# EasyEDA Pro project ProDoc_TB6612.epro

# Schematic Schematic1_1

## Sheets
1 stm32最小系统: Create Date: 2023-11-04; Page Name: stm32最小系统; Project Name: 四电机驱动板1; Schematic Name: Schematic1_1; Update Date: 2023-11-05; Add into BOM: yes; Convert to PCB: yes
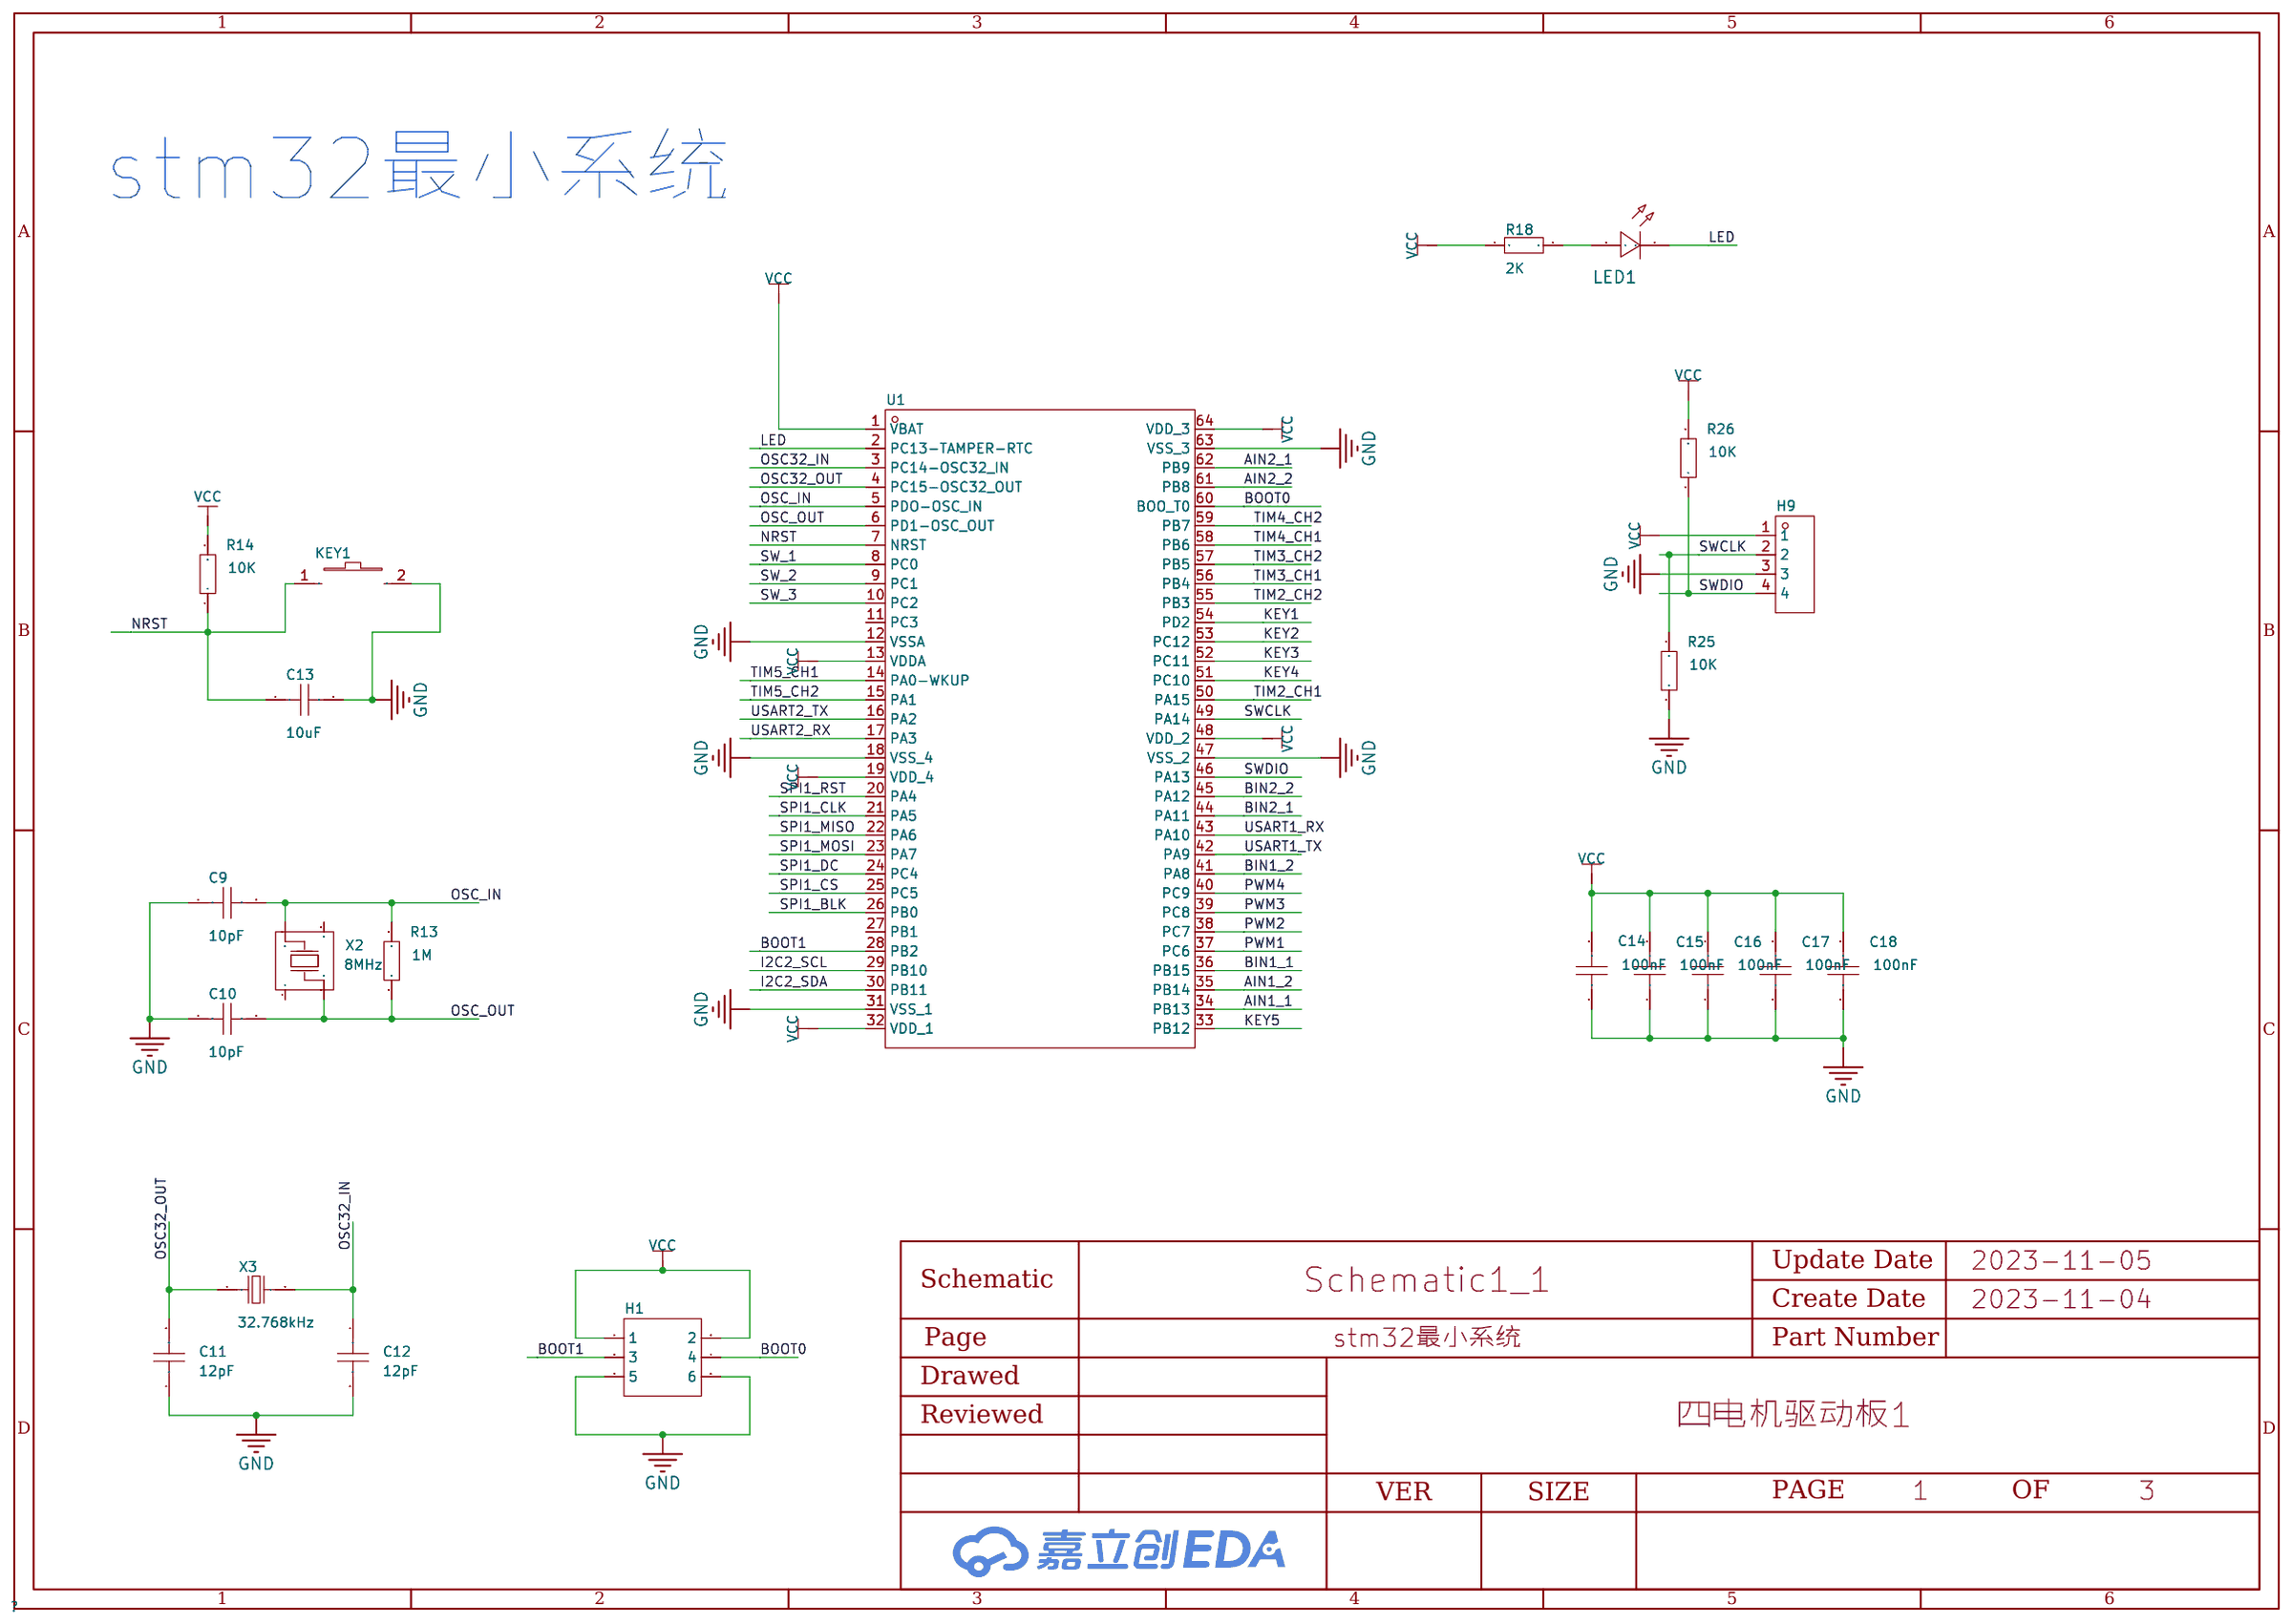
[diagram p0: stm32最小系统]
2 电机驱动TB6612: Page Name: 电机驱动TB6612.Schematic1_1; Company: 嘉立创EDA; Page Size: A4; Version: V1.0
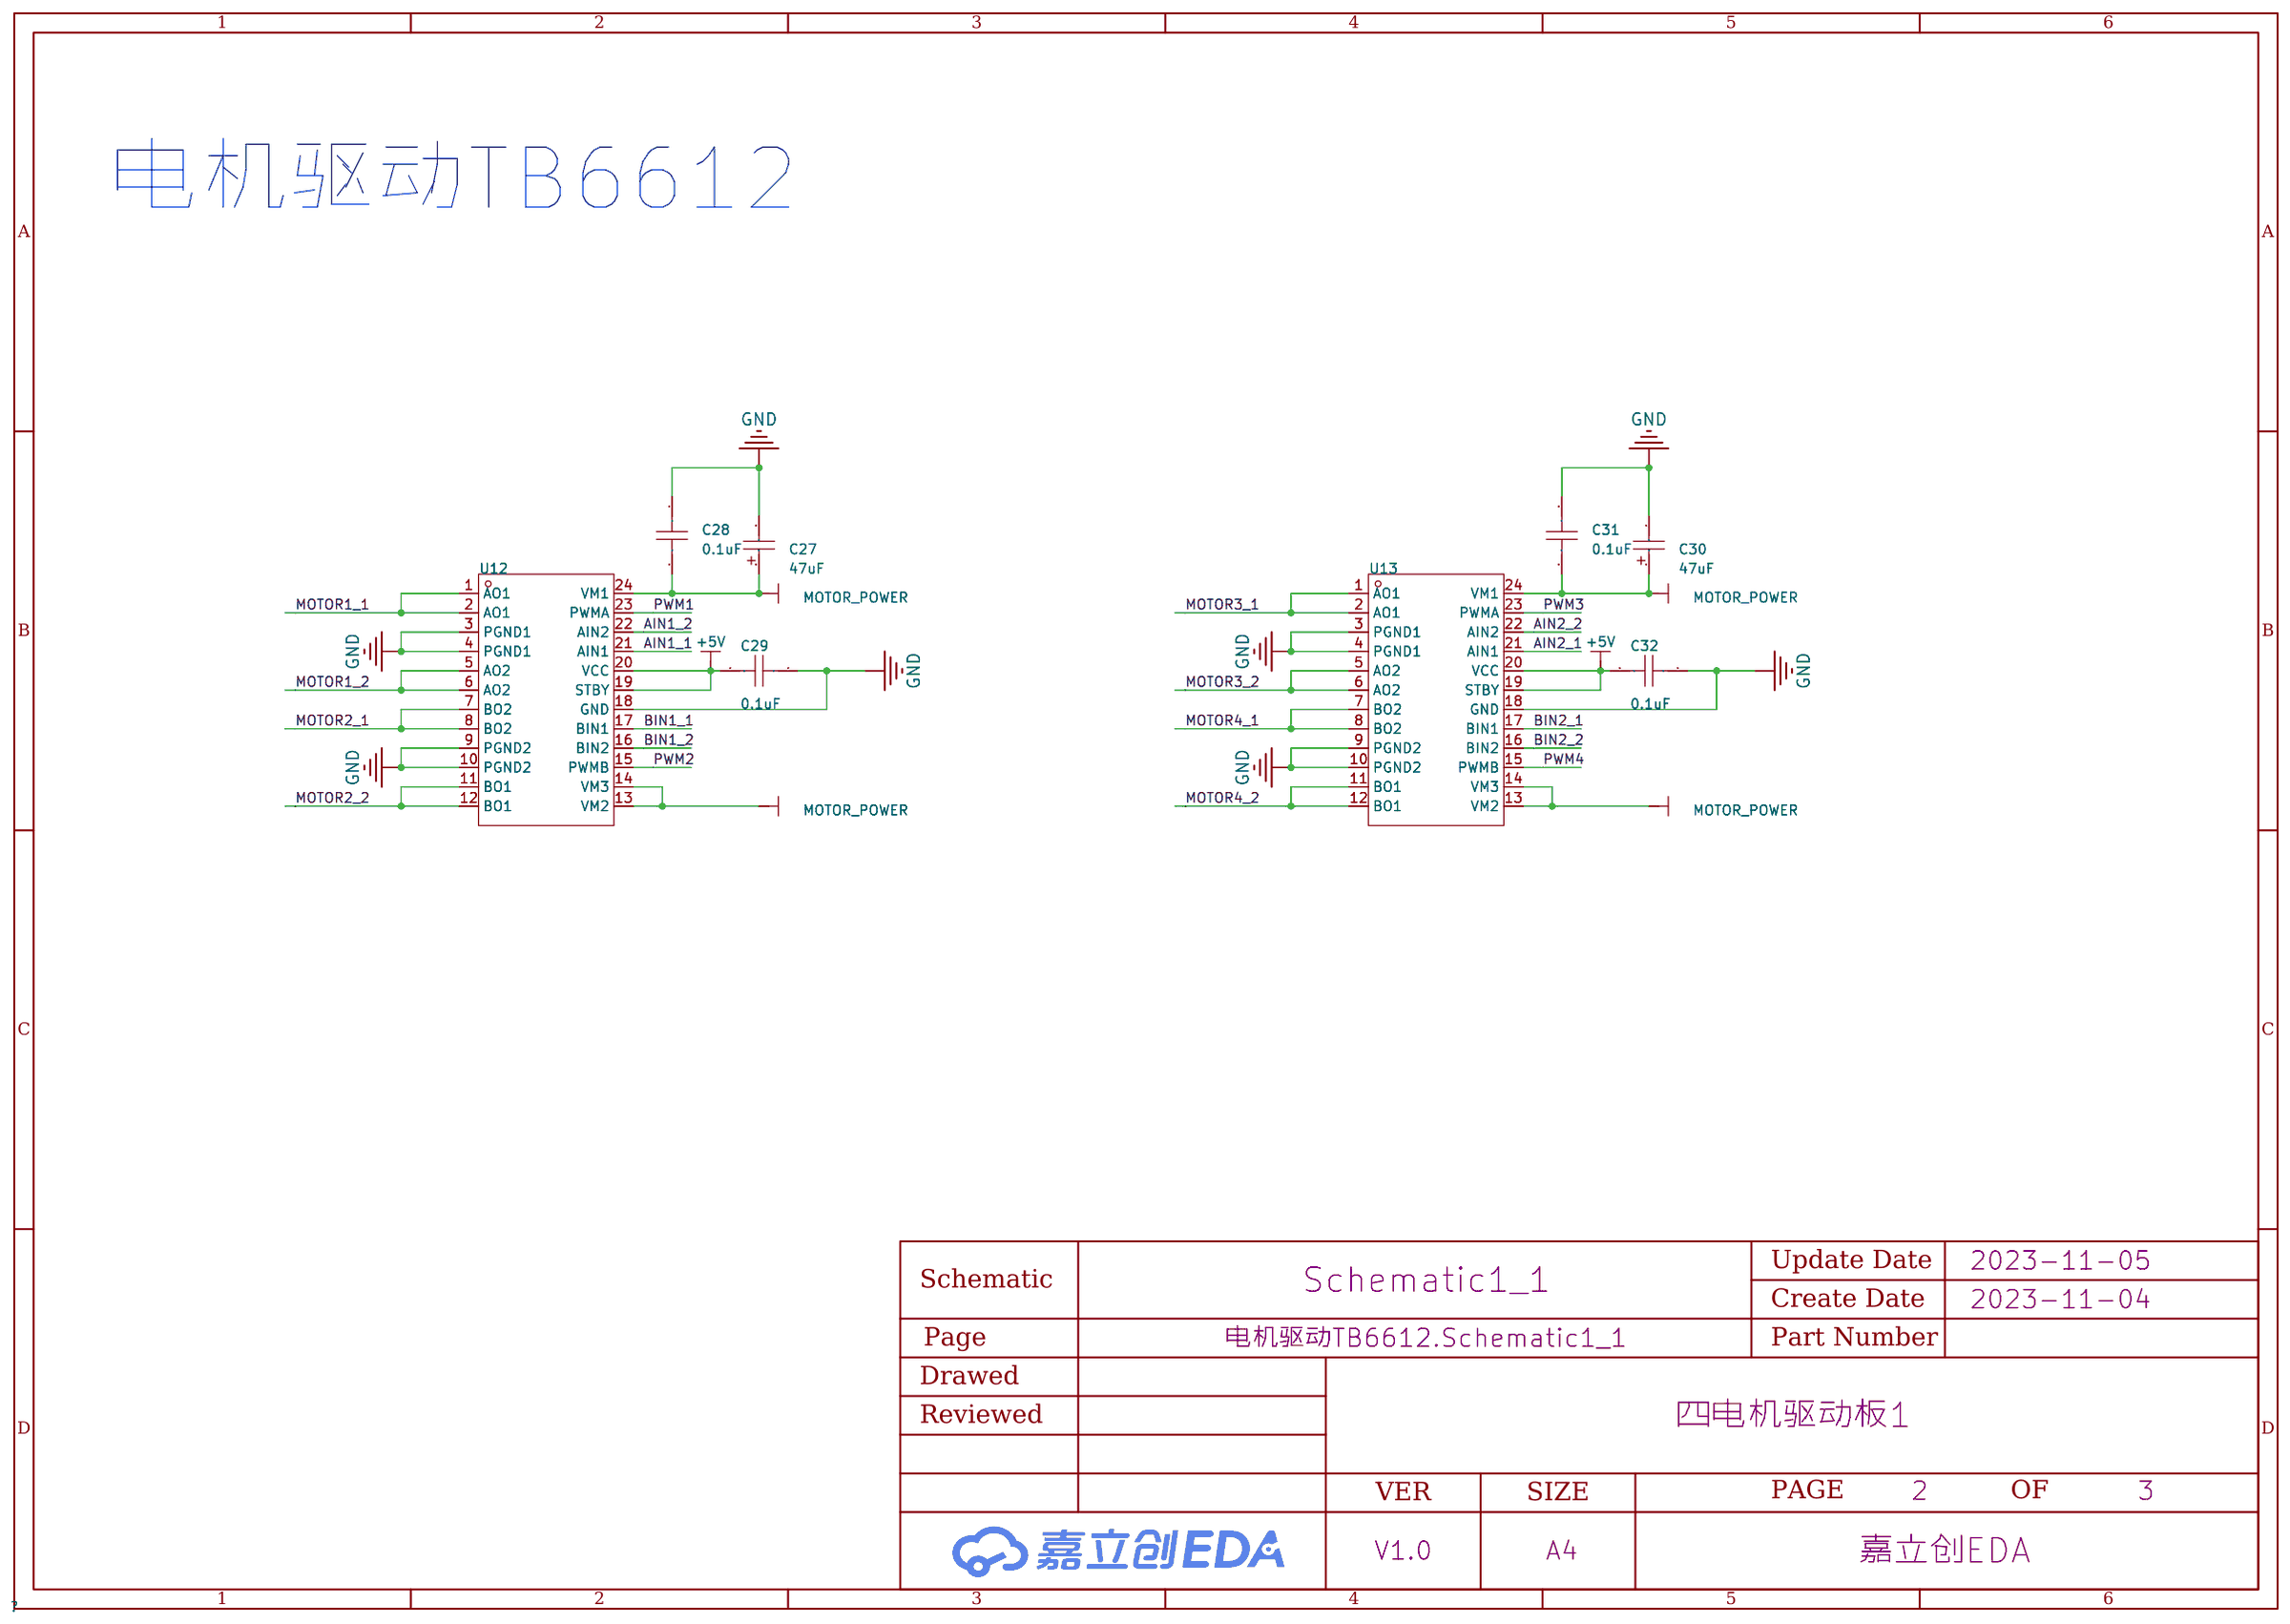
[diagram p1: 电机驱动TB6612]
3 其他模块: Page Name: 其他模块; Update Date: 2023-11-04; Company: 嘉立创EDA; Page Size: A4; Version: V1.0
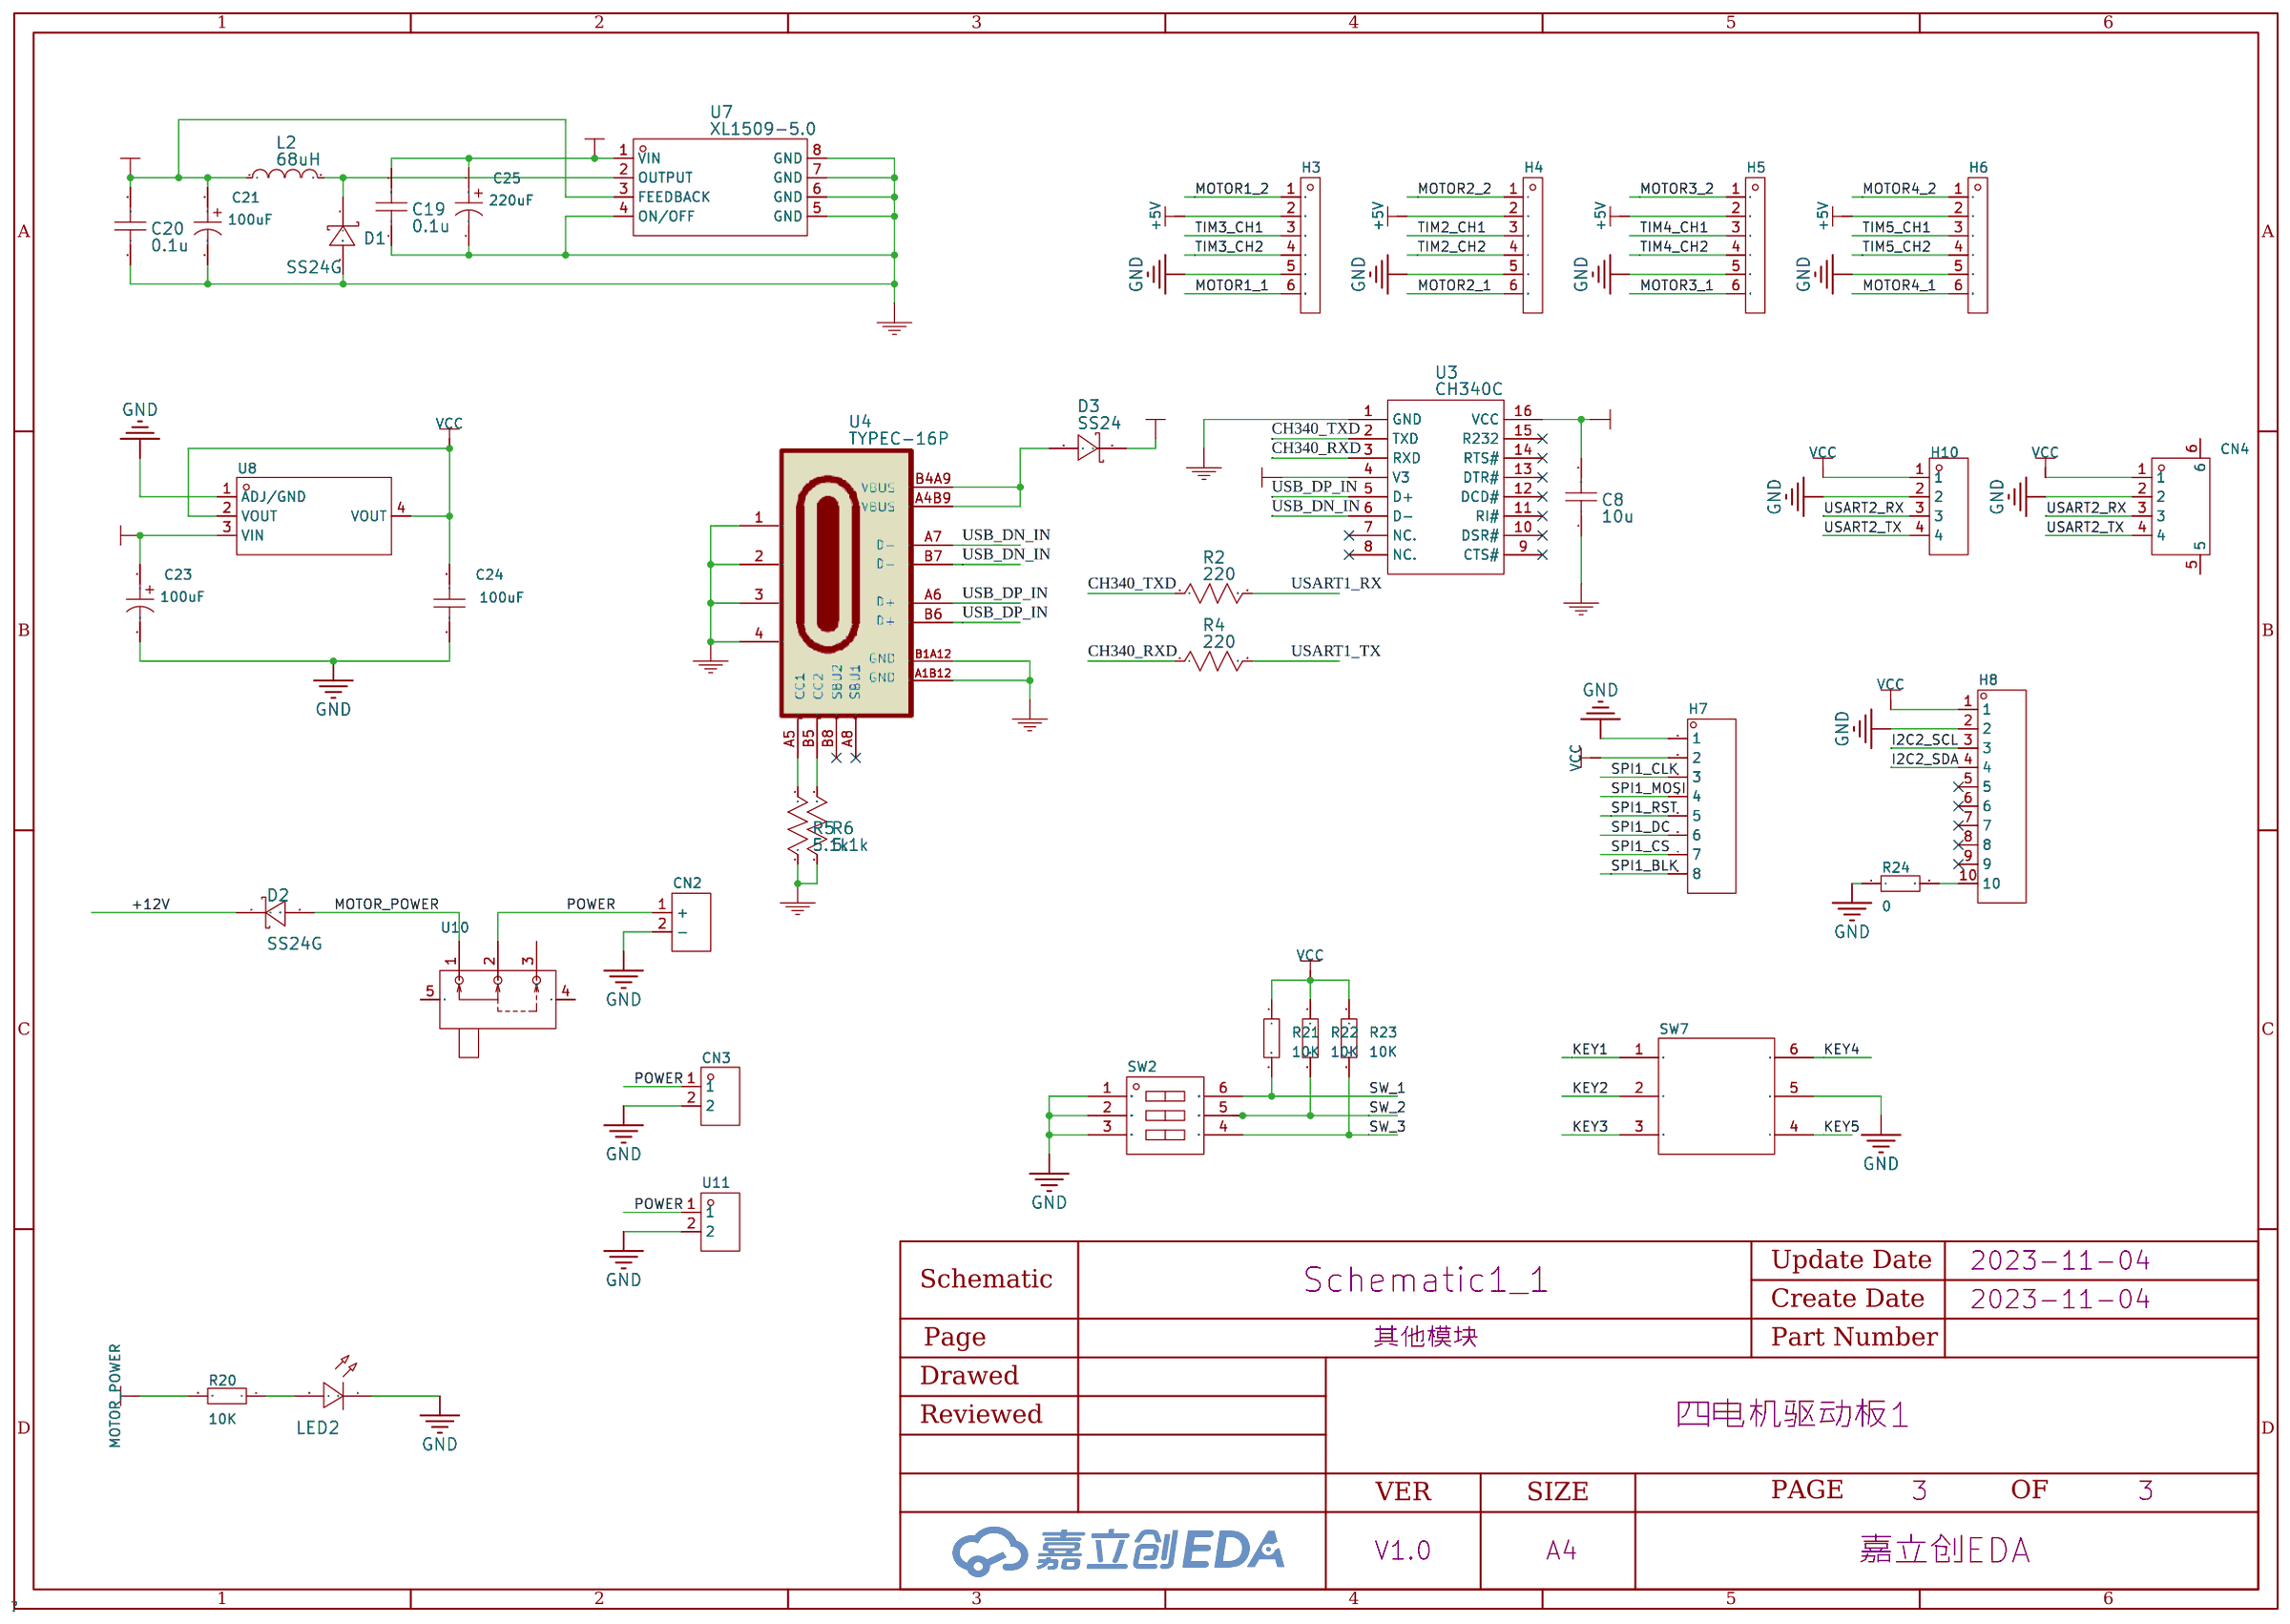
[diagram p2: 其他模块]

## Parts
sheet stm32最小系统
C9  10pF  [C0603]
C10  10pF  [C0603]
C11  12pF  [C0603]
C12  12pF  [C0603]
C13  10uF  [C0603]
C14  100nF  [C0603]
C15  100nF  [C0603]
C16  100nF  [C0603]
C17  100nF  [C0603]
C18  100nF  [C0603]
H1  -  [HDR-TH_6P-P2.54-V-F-R2-C3-S2.54]
H9  -  [HDR-TH_4P-P2.54-V-M]
KEY1  轻触开关3x4x2  [SW-SMD_L4.0-W2.9-LS5.0]
LED1  -  [LED0805-RD_RED]
R13  1M  [R0603]
R14  10K  [R0603]
R18  2K  [R0603]
R25  10K  [R0603]
R26  10K  [R0603]
U1  -  [LQFP-64_L10.0-W10.0-P0.50-LS12.0-BL]
X2  8MHz  [OSC-SMD_4P-L3.2-W2.5-BL]
X3  32.768kHz  [FC-135R_L3.2-W1.5]
sheet 其他模块
C8  10u  [C0603]
C19  0.1u  [C0603]
C20  0.1u  [C0603]
C21  100uF  [CAP-SMD_BD6.3-L6.6-W6.6-LS7.3-FD]
C23  100uF  [CAP-SMD_BD6.3-L6.6-W6.6-LS7.3-FD]
C24  100uF  [C0603]
C25  220uF  [CAP-SMD_BD6.3-L6.6-W6.6-LS7.3-FD]
CN2  XT30UPB-F  [CONN-TH_XT30UPB-F]
CN3  XT30U-M  [CONN-TH_XT30U-M]
CN4  PH-4P卧贴  [CONN-SMD_PH2.0-4PWB]
D1  SS24G  [SMA_L4.4-W2.8-LS5.4-RD]
D2  SS24G  [SMA_L4.4-W2.8-LS5.4-RD]
D3  SS24  [SMA_L4.3-W2.6-LS5.2-RD]
H3  -  [CONN-TH_XH-6AW]
H4  -  [CONN-TH_XH-6AW]
H5  -  [CONN-TH_XH-6AW]
H6  -  [CONN-TH_XH-6AW]
H7  -  [HDR-TH_8P-P2.54-V-M]
H8  -  [HDR-TH_10P-P2.54-V-M-1]
H10  -  [HDR-TH_4P-P2.54-V-F]
L2  68uH  [IND-SMD_L5.8-W5.2_CD54T125NP-100MC]
LED2  -  [LED0805-RD_RED]
R2  220  [R0603]
R4  220  [R0603]
R5  5.1k  [R0603]
R6  5.1k  [R0603]
R20  10K  [R0603]
R21  10K  [R0603]
R22  10K  [R0603]
R23  10K  [R0603]
R24  0  [R0603]
SW2  TO-03  [SW-SMD_6P-L7.6-W6.3-P2.54-LS9.8]
SW7  7*7*5-6P-L WX  [SW-SMD_6P-L7.0-W7.0-P1.40-LS7.4]
U3  CH340C  [SOP-16_L10.0-W3.9-P1.27-LS6.0-BL]
U4  TYPEC-16P  [TYPEC]
U7  XL1509-5.0  [SOIC-8_L5.0-W4.0-P1.27-LS6.0-BL]
U8  AMS1117-3.3  [SOT-223_L6.5-W3.5-P2.30-LS7.0-BR]
U10  SS-12F23-G4  [SW-TH_SS-12F23-G040]
U11  KF127-5.08-2P  [CONN-TH_P5.08_KF127-5.08-2P]
sheet 电机驱动TB6612
C27  47uF  [CAP-SMD_L6.0-W3.2-R-RD]
C28  0.1uF  [C0603]
C29  0.1uF  [C0603]
C30  47uF  [CAP-SMD_L6.0-W3.2-R-RD]
C31  0.1uF  [C0603]
C32  0.1uF  [C0603]
U12  TB6612FNG(O,C,8,EL  [SSOP-24_L8.4-W5.8-P0.65-LS7.8-BL]
U13  TB6612FNG(O,C,8,EL  [SSOP-24_L8.4-W5.8-P0.65-LS7.8-BL]

## Library data of the parts
C9-C12 C24 C28 C29 C31 C32 = CAP_0603: Supplier Footprint: 0603
C13 = C0603: 容值:100nF;精度:±10%;额定电压:50V;材质(温度系数):X7R;; LCSC Part Name: 100nF ±10% 50V; Supplier Part: C14663; Manufacturer: YAGEO(国巨); Manufacturer Part: CC0603KRX7R9BB104; Supplier Footprint: 0603; JLCPCB Part Class: Basic Part; Datasheet: https://atta.szlcsc.com/upload/public/pdf/source/20170116/1484561234239.pdf; Supplier: LCSC; Tolerance: ±10%; Voltage Rated: 50V; Temperature Coefficient: X7R
C14-C18 = CAP_0805: Supplier Footprint: 0805
H1 = HDR-F_2.54_2x3: Supplier Part: C92272; Supplier Footprint: 插件
H9 = HDR-M_2.54_1x4P: Supplier Part: C492403; Supplier Footprint: 插件
KEY1 = 轻触开关3x4x2: 触点电流:50mA;额定电压(DC):12V;电路结构:单刀单掷;安装方式:立贴;按钮形状:圆形按钮;带灯:-;开关长度:4mm;开关宽度:3mm;开关高度:2mm;; LCSC Part Name: 3x4x2  柱高0.5; Supplier Part: C26638; Manufacturer: 国产; Supplier Footprint: SMD; JLCPCB Part Class: 扩展库; Datasheet: https://atta.szlcsc.com/upload/public/pdf/source/20150923/1457707412058.pdf; Supplier: LCSC; Contact Current: 50mA; Voltage Rating (DC): 12V; Circuit: 单刀单掷; Mounting Style: 立贴; Actuator Style: 圆形按钮; Switch Length: 4mm; Switch Width: 3mm; Switch Height: 2mm
LED1 LED2 = LED_0805-R: Supplier Footprint: 0805
R13 R14 R18 R20-R26 = Res_0603: Supplier Footprint: 0603
U1 = STM32F103RCT6: 主频（MAX):72MHz;工作电压:2V ~ 3.6V;; Supplier Part: C8323; Manufacturer: ST(意法半导体); Supplier Footprint: LQFP-64_10x10x05P; JLCPCB Part Class: Extended Part; Datasheet: https://atta.szlcsc.com/upload/public/pdf/source/20161130/1480498797345.pdf; Supplier: LCSC; Speed: 72MHz; Voltage - Supply (Vcc/Vdd): 2V ~ 3.6V; Program Memory Size: 256KB; RAM Size: 48KB; Number of I/O: 51; A/D: 16x12bit; D/A: 2x12bit; PWM: 18; LCD: LCD parallel interface, 8080/6800 modes; UART/USART: 3 USART+2 UART; SPI: 3; I2C（SMBUS/PMBUS）: 2; USB Device: 1; CAN: 1
X2 = TAXM8M4RDBCCT2T: 晶振类型:SMD 谐振器;频率:8MHz;频率公差:±10ppm;频率稳定度:±15ppm;负载电容:10pF;等效串联电阻(ESR):250Ω;工作温度:-;; LCSC Part Name: 8MHz ±10ppm 10pF; Supplier Part: C400090; Manufacturer: TAE(雅晶鑫); Supplier Footprint: SMD3225-4P; JLCPCB Part Class: 扩展库; Datasheet: https://atta.szlcsc.com/upload/public/pdf/source/20190626/C400090_CF95B89E745AFE4EF2E392EF8AC009D6.pdf; Supplier: LCSC; Crystal Type: SMD 谐振器; Frequency Tolerance: ±10ppm; Frequency Stability: ±15ppm; Load Capacitance: 10pF; Equivalent Series Resistance (ESR): 250Ω
X3 = Q13FC1350000400: 晶振类型:贴片无源晶振;频率:32.768kHz;频率公差:±20ppm;负载电容:12.5pF;等效串联电阻(ESR):70kΩ;工作温度:-40~+85;; LCSC Part Name: 32.768kHz ±20ppm 12.5pF; Supplier Part: C32346; Manufacturer: EPSON(爱普生); Supplier Footprint: SMD3215-2P; JLCPCB Part Class: 基础库; Datasheet: https://atta.szlcsc.com/upload/public/pdf/source/20190108/C32346_746D6B07EAF90824457A96480007685F.pdf; Supplier: LCSC; Crystal Type: 贴片无源晶振; Frequency Tolerance: ±20ppm; Load Capacitance: 12.5pF; Equivalent Series Resistance (ESR): 70kΩ; Operating Temperature: -40~+85
C8 = 10u
C19 C20 = 0.1u
C21 C23 = XT100UF16V90RV0074: 容值:100uF;精度:±20%;额定电压:16V;电容体直径:6.3mm;电容体长度:7.7mm;纹波电流:85mA@120Hz;工作寿命:2000hrs@105;工作温度:-55~+105;; LCSC Part Name: 100uF ±20% 16V; Supplier Part: C2992605; Manufacturer: KNSCHA(科尼盛); Supplier Footprint: SMD,D6.3xL7.7mm; Datasheet: https://atta.szlcsc.com/upload/public/pdf/source/20220628/7CAC947F1CF7B3760324B7CEF365CD7C.pdf; Supplier: LCSC; Tolerance: ±20%; Rated Voltage: 16V; φD: 6.3mm; L: 7.7mm; Ripple Current: 85mA@120Hz; Lifetime @ Temp: 2000hrs@105; Operating Temperature: -55~+105
C25 = XT220UF25V90RV0075: 容值:220uF;额定电压:25V;电容体直径:-;电容体长度:-;纹波电流:-;等效串联电阻:-;工作寿命:-;; LCSC Part Name: 220uF 25V; Supplier Part: C2992606; Manufacturer: KNSCHA(科尼盛); Supplier Footprint: SMD,6.3x7.7mm; JLCPCB Part Class: 扩展库; Datasheet: https://atta.szlcsc.com/upload/public/pdf/source/20220628/B81E91792433B702C6CB5381AD404A15.pdf; Supplier: LCSC; Rated Voltage: 25V
CN2 = XT30UPB-F: 模型插头连接器; Supplier Part: C108769; Manufacturer: AMASS(艾迈斯); Supplier Footprint: 间距5mm; JLCPCB Part Class: 扩展库; Datasheet: https://atta.szlcsc.com/upload/public/pdf/source/20180126/C108769_15169557890251308829.pdf; Supplier: LCSC
CN3 = XT30U-M: 模型插头轻量版锂电池插头; LCSC Part Name: XT30U-M 公头; Supplier Part: C99101; Manufacturer: AMASS(艾迈斯); JLCPCB Part Class: 扩展库; Datasheet: https://atta.szlcsc.com/upload/public/pdf/source/20170606/1496716542582.pdf; Supplier: LCSC
CN4 = PH-4P卧贴: 参考系列:PH;间距:2mm;插针结构:1x4P;排数:1;每排PIN数:4;行距:-;安装方式:-;触头材质:-;; LCSC Part Name: PH2.0-4PWB  4P 间距2.0mm; Supplier Part: C50137; Manufacturer: BOOMELE(博穆精密); Supplier Footprint: SMD,P=2mm; JLCPCB Part Class: 扩展库; Datasheet: https://atta.szlcsc.com/upload/public/pdf/source/20201021/C50137_92282A9B69C22D3BCC62949EB13F278D.pdf; Supplier: LCSC; Reference Series: PH; Pitch: 2mm; Pins Structure: 1x4P; Number of Rows: 1; Number of PINs Per Row: 4
D1 D2 = SS24G: Supplier: LCSC; Supplier Part: C183481; Manufacturer: SK; JLCPCB Part Class: Extended Part
D3 = SS24: Supplier: LCSC; Manufacturer: MDD; Supplier Part: C50645; JLCPCB Part Class: Extended Part
H3-H6 = XH2.54-6P卧插: 参考系列:XH;间距:2.5mm;插针结构:1x6P;排数:1;每排PIN数:6;行距:-;安装方式:-;触头材质:-;; LCSC Part Name: XH-6AW，6P，脚距2.5mm，卧插; Supplier Part: C8876; Manufacturer: BOOMELE(博穆精密); Manufacturer Part: XH-6AW; LCSC On Sale: 1; Supplier Footprint: 插件,P=2.5mm; JLCPCB On Sale: 1; Datasheet: https://atta.szlcsc.com/upload/public/pdf/source/20151222/1457707652916.pdf; Supplier: LCSC; Reference Series: XH; Pitch: 2.5mm; Pins Structure: 1x6P; Number of Rows: 1; Number of PINs Per Row: 6; JLCPCB Part Class: 扩展库
H7 = HDR-M_2.54_1x8P: Supplier Part: C124381; Supplier Footprint: 插件
H8 = HDR-M_2.54_1x10P: Supplier Part: C57369; Supplier Footprint: 插件
H10 = HDR-F_2.54_1x4P: Supplier Part: C2718488; Supplier Footprint: 插件
L2 = CD54T125NP-100MC: Supplier: LCSC; Supplier Part: C171575; Manufacturer: Sumida; JLCPCB Part Class: Extended Part
R2 R4 = 220
R5 R6 = 5.1k
SW2 = TO-03: 拨码开关贴片黑色03P-3PIN间距2.54mm立式贴片正拨平拨3位SMD; LCSC Part Name: 拨码开关贴片黑色03P-3PIN间距2.54mm立式贴片正拨平拨3位SMD; Supplier Part: C703800; Manufacturer: Yuandi(台湾元迪); Supplier Footprint: SMD; JLCPCB Part Class: 扩展库; Datasheet: https://atta.szlcsc.com/upload/public/pdf/source/20200720/C703800_80E8AF9DC4C3CB8A32EAD0AE4E67587B.pdf; Supplier: LCSC
SW7 = 7*7*5-6P-L WX: 额定电流(DC)：50mA 额定电压(DC)：12V 电路结构：单刀五掷 机械寿命：30000 安装方式：SMD 工作温度：-20~+70 开关长度：7.4mm 开关宽度：7.4mm 开关高度：5mm; Supplier Part: C2858287; Manufacturer: SHOU HAN(首韩); Supplier Footprint: SMD; JLCPCB Part Class: 扩展库; Datasheet: https://atta.szlcsc.com/upload/public/pdf/source/20210806/C2858287_7956E179246BF43E1C1955FBC790E2E6.pdf; Supplier: LCSC
U3 = CH340C: Supplier: LCSC; Manufacturer: WCH(南京沁恒); Supplier Part: C84681; JLCPCB Part Class: Extended Part
U4 = TYPEC-16P
U7 = XL1509-5.0: Supplier: LCSC; Supplier Part: C2681225; Manufacturer: UMW(友台半导体); JLCPCB Part Class: Extended Part
U8 = AMS1117-3.3_C351785: Supplier Part: C351785; Manufacturer: PUOLOP(迪浦); Supplier Footprint: SOT-223; JLCPCB Part Class: 扩展库; Datasheet: https://atta.szlcsc.com/upload/public/pdf/source/20210915/EA806799CEEC3F52E0A4FA8303A508AC.pdf; Supplier: LCSC
U10 = SS-12F23-G4: 电路结构:单刀双掷;安装方式:卧插;开关颜色:黑色;滑钮形状:矩形柱状;引脚样式:PC引脚;开关长度:13mm;开关宽度:5.8mm;开关高度:9mm;; LCSC Part Name: 拨动开关; Supplier Part: C2998806; Manufacturer: DEALON(德艺隆); Supplier Footprint: 插件; JLCPCB Part Class: 扩展库; Datasheet: https://atta.szlcsc.com/upload/public/pdf/source/20220428/B341684C4335C21BC408331FBC341DAE.pdf; Supplier: LCSC; Circuit: 单刀双掷; Mounting Style: 卧插; Actuator Color: 黑色; Actuator Style: 矩形柱状; Pin Style: PC引脚; Switch Length: 13mm; Switch Width: 5.8mm; Switch Height: 9mm
U11 = KF127-5.08-2P: 间距:5.08mm;排数:1;每排PIN数:2;安装方式:直针;额定电流:15A;额定电压:250V;线规 - AWG:14~26;线规 - mm?:1.5;工作温度范围:-40~+105;颜色:绿色;; LCSC Part Name: 5.08mm 排数:1 每排P数:2 直针 可拼接 铜 环保; Supplier Part: C474906; Manufacturer: KEFA(科发); Supplier Footprint: P=5.08mm; JLCPCB Part Class: 扩展库; Datasheet: https://atta.szlcsc.com/upload/public/pdf/source/20200115/C474906_30398C25D2112436770FB13658A99DF4.pdf; Supplier: LCSC; Pitch: 5.08mm; Number of Rows: 1; Number of PINs Per Row: 2; Mounting Style: 直针; Current Rating (Max): 15A; Voltage Rating (Max): 250V; Wire Gauge - AWG: 14~26; Wire Gauge - mm?: 1.5; Operating Temperature Range: -40~+105; Color: 绿色
C27 C30 = TAJC476K016RNJ: 容值:47uF;精度:±10%;额定电压:16V;等效串联电阻:500mΩ@100kHz;; LCSC Part Name: 47uF ±10% 16V; Supplier Part: C7219; Manufacturer: Kyocera AVX; Supplier Footprint: CASE-C-6032; JLCPCB Part Class: 扩展库; Datasheet: https://atta.szlcsc.com/upload/public/pdf/source/20160107/1457707749304.pdf; Supplier: LCSC; Tolerance: ±10%; Rated Voltage: 16V; Equivalent Series Resistance(ESR): 500mΩ@100kHz; Operating Temperature: -55℃~+125℃
U12 U13 = TB6612FNG(O,C,8,EL: 双直流电机驱动器集成电路; Supplier Part: C88224; Manufacturer: TOSHIBA(东芝); Supplier Footprint: SSOP-24-208mil; JLCPCB Part Class: 扩展库; Datasheet: https://atta.szlcsc.com/upload/public/pdf/source/20170412/1491969113864.pdf; Supplier: LCSC

## Nets
+5V: C20.2 C21.1 C23.1 C29.2 C32.2 D3.1(K) H3.2 H4.2 H5.2 H6.2 L2.1 U7.3(FEEDBACK) U8.3(VIN) U12.19(STBY) U12.20(VCC) U13.19(STBY) U13.20(VCC)
+12V: C19.2 C25.1 D2.1 U7.1(VIN)
GND: C8.1 C9.1 C10.1 C11.1 C12.2 C13.2 C14.1 C15.1 C16.1 C17.1 C18.1 C19.1 C20.1 C21.2 C23.2 C24.1 C25.2 C27.2 C28.1 C29.1 C30.2 C31.1 C32.1 CN2.2(-) CN3.2 CN4.2 D1.2 H1.5 H1.6 H3.5 H4.5 H5.5 H6.5 H7.1 H8.2 H9.3 H10.2 KEY1.2 LED2.1(C) R5.1 R6.1 R24.1 R25.1 SW2.1(PIN1) SW2.2(PIN2) SW2.3(PIN3) SW7.5 U1.12(VSSA) U1.18(VSS_4) U1.31(VSS_1) U1.47(VSS_2) U1.63(VSS_3) U3.1(GND) U4.1 U4.2(1) U4.3(1) U4.4(1) U4.A1B12(1) U4.B1A12(1) U7.4(ON/OFF) U7.5(GND) U7.6(GND) U7.7(GND) U7.8(GND) U8.1(ADJ/GND) U11.2 U12.3(PGND1) U12.4(PGND1) U12.9(PGND2) U12.10(PGND2) U12.18(GND) U13.3(PGND1) U13.4(PGND1) U13.9(PGND2) U13.10(PGND2) U13.18(GND)
VCC: C8.2 C14.2 C15.2 C16.2 C17.2 C18.2 C24.2 CN4.1 H1.1 H1.2 H7.2 H8.1 H9.1 H10.1 R14.2 R18.2 R21.1 R22.1 R23.1 R26.2 U1.1(VBAT) U1.13(VDDA) U1.19(VDD_4) U1.32(VDD_1) U1.48(VDD_2) U1.64(VDD_3) U3.4(V3) U3.16(VCC) U8.2(VOUT) U8.4(VOUT)
AIN1_1: U1.34(PB13) U12.21(AIN1)
AIN1_2: U1.35(PB14) U12.22(AIN2)
AIN2_1: U1.62(PB9) U13.21(AIN1)
AIN2_2: U1.61(PB8) U13.22(AIN2)
BIN1_1: U1.36(PB15) U12.17(BIN1)
BIN1_2: U1.41(PA8) U12.16(BIN2)
BIN2_1: U1.44(PA11) U13.17(BIN1)
BIN2_2: U1.45(PA12) U13.16(BIN2)
BOOT0: H1.4 U1.60(BOO_T0)
BOOT1: H1.3 U1.28(PB2)
CH340_RXD: R4.1 U3.3(RXD)
CH340_TXD: R2.1 U3.2(TXD)
I2C2_SCL: H8.3 U1.29(PB10)
I2C2_SDA: H8.4 U1.30(PB11)
KEY1: SW7.1 U1.54(PD2)
KEY2: SW7.2 U1.53(PC12)
KEY3: SW7.3 U1.52(PC11)
KEY4: SW7.6 U1.51(PC10)
KEY5: SW7.4 U1.33(PB12)
LED: LED1.1(C) U1.2(PC13-TAMPER-RTC)
MOTOR1_1: H3.6 U12.1(AO1) U12.2(AO1)
MOTOR1_2: H3.1 U12.5(AO2) U12.6(AO2)
MOTOR2_1: H4.6 U12.7(BO2) U12.8(BO2)
MOTOR2_2: H4.1 U12.11(BO1) U12.12(BO1)
MOTOR3_1: H5.6 U13.1(AO1) U13.2(AO1)
MOTOR3_2: H5.1 U13.5(AO2) U13.6(AO2)
MOTOR4_1: H6.6 U13.7(BO2) U13.8(BO2)
MOTOR4_2: H6.1 U13.11(BO1) U13.12(BO1)
MOTOR_POWER: C27.1 C28.2 C30.1 C31.2 D2.2 R20.2 U10.1 U12.13(VM2) U12.14(VM3) U12.24(VM1) U13.13(VM2) U13.14(VM3) U13.24(VM1)
NRST: C13.1 KEY1.1 R14.1 U1.7(NRST)
OSC32_IN: C12.1 U1.3(PC14-OSC32_IN) X3.2
OSC32_OUT: C11.2 U1.4(PC15-OSC32_OUT) X3.1
OSC_IN: C9.2 R13.2 U1.5(PDO-OSC_IN) X2.3
OSC_OUT: C10.2 R13.1 U1.6(PD1-OSC_OUT) X2.1
POWER: CN2.1(+) CN3.1 U10.2 U11.1
PWM1: U1.37(PC6) U12.23(PWMA)
PWM2: U1.38(PC7) U12.15(PWMB)
PWM3: U1.39(PC8) U13.23(PWMA)
PWM4: U1.40(PC9) U13.15(PWMB)
SPI1_BLK: H7.8 U1.26(PB0)
SPI1_CLK: H7.3 U1.21(PA5)
SPI1_CS: H7.7 U1.25(PC5)
SPI1_DC: H7.6 U1.24(PC4)
SPI1_MISO: U1.22(PA6)
SPI1_MOSI: H7.4 U1.23(PA7)
SPI1_RST: H7.5 U1.20(PA4)
SW_1: R21.2 SW2.6(PIN6) U1.8(PC0)
SW_2: R22.2 SW2.5(PIN5) U1.9(PC1)
SW_3: R23.2 SW2.4(PIN4) U1.10(PC2)
SWCLK: H9.2 R25.2 U1.49(PA14)
SWDIO: H9.4 R26.1 U1.46(PA13)
TIM2_CH1: H4.3 U1.50(PA15)
TIM2_CH2: H4.4 U1.55(PB3)
TIM3_CH1: H3.3 U1.56(PB4)
TIM3_CH2: H3.4 U1.57(PB5)
TIM4_CH1: H5.3 U1.58(PB6)
TIM4_CH2: H5.4 U1.59(PB7)
TIM5_CH1: H6.3 U1.14(PA0-WKUP)
TIM5_CH2: H6.4 U1.15(PA1)
USART1_RX: R2.2 U1.43(PA10)
USART1_TX: R4.2 U1.42(PA9)
USART2_RX: CN4.3 H10.3 U1.17(PA3)
USART2_TX: CN4.4 H10.4 U1.16(PA2)
USB_DN_IN: U3.6(D-) U4.A7(1) U4.B7(1)
USB_DP_IN: U3.5(D+) U4.A6(1) U4.B6(1)
$1N10210: LED1.2(A) R18.1
$3N961: D1.1 L2.2 U7.2(OUTPUT)
$3N15267: H8.10 R24.2
$3N17066: LED2.2(A) R20.1
$3N19129: R5.2 U4.A5(1)
$3N19130: R6.2 U4.B5(1)
$3N19140: D3.2(A) U4.A4B9(1) U4.B4A9(1)

Not connected (* = marked no-connect by the designer): CN4 5 6; H8 5* 6* 7* 8* 9*; U1 11(PC3) 27(PB1); U3 7(NC.)* 8(NC.)* 9(CTS#)* 10(DSR#)* 11(RI#)* 12(DCD#)* 13(DTR#)* 14(RTS#)* 15(R232)*; U4 A8(1)* B8(1)*; U10 3 4 5; X2 2 4

## Notes on the sheets
sheet 1
- stm32最小系统
sheet 2
- 电机驱动TB6612

# Board PCB1_1
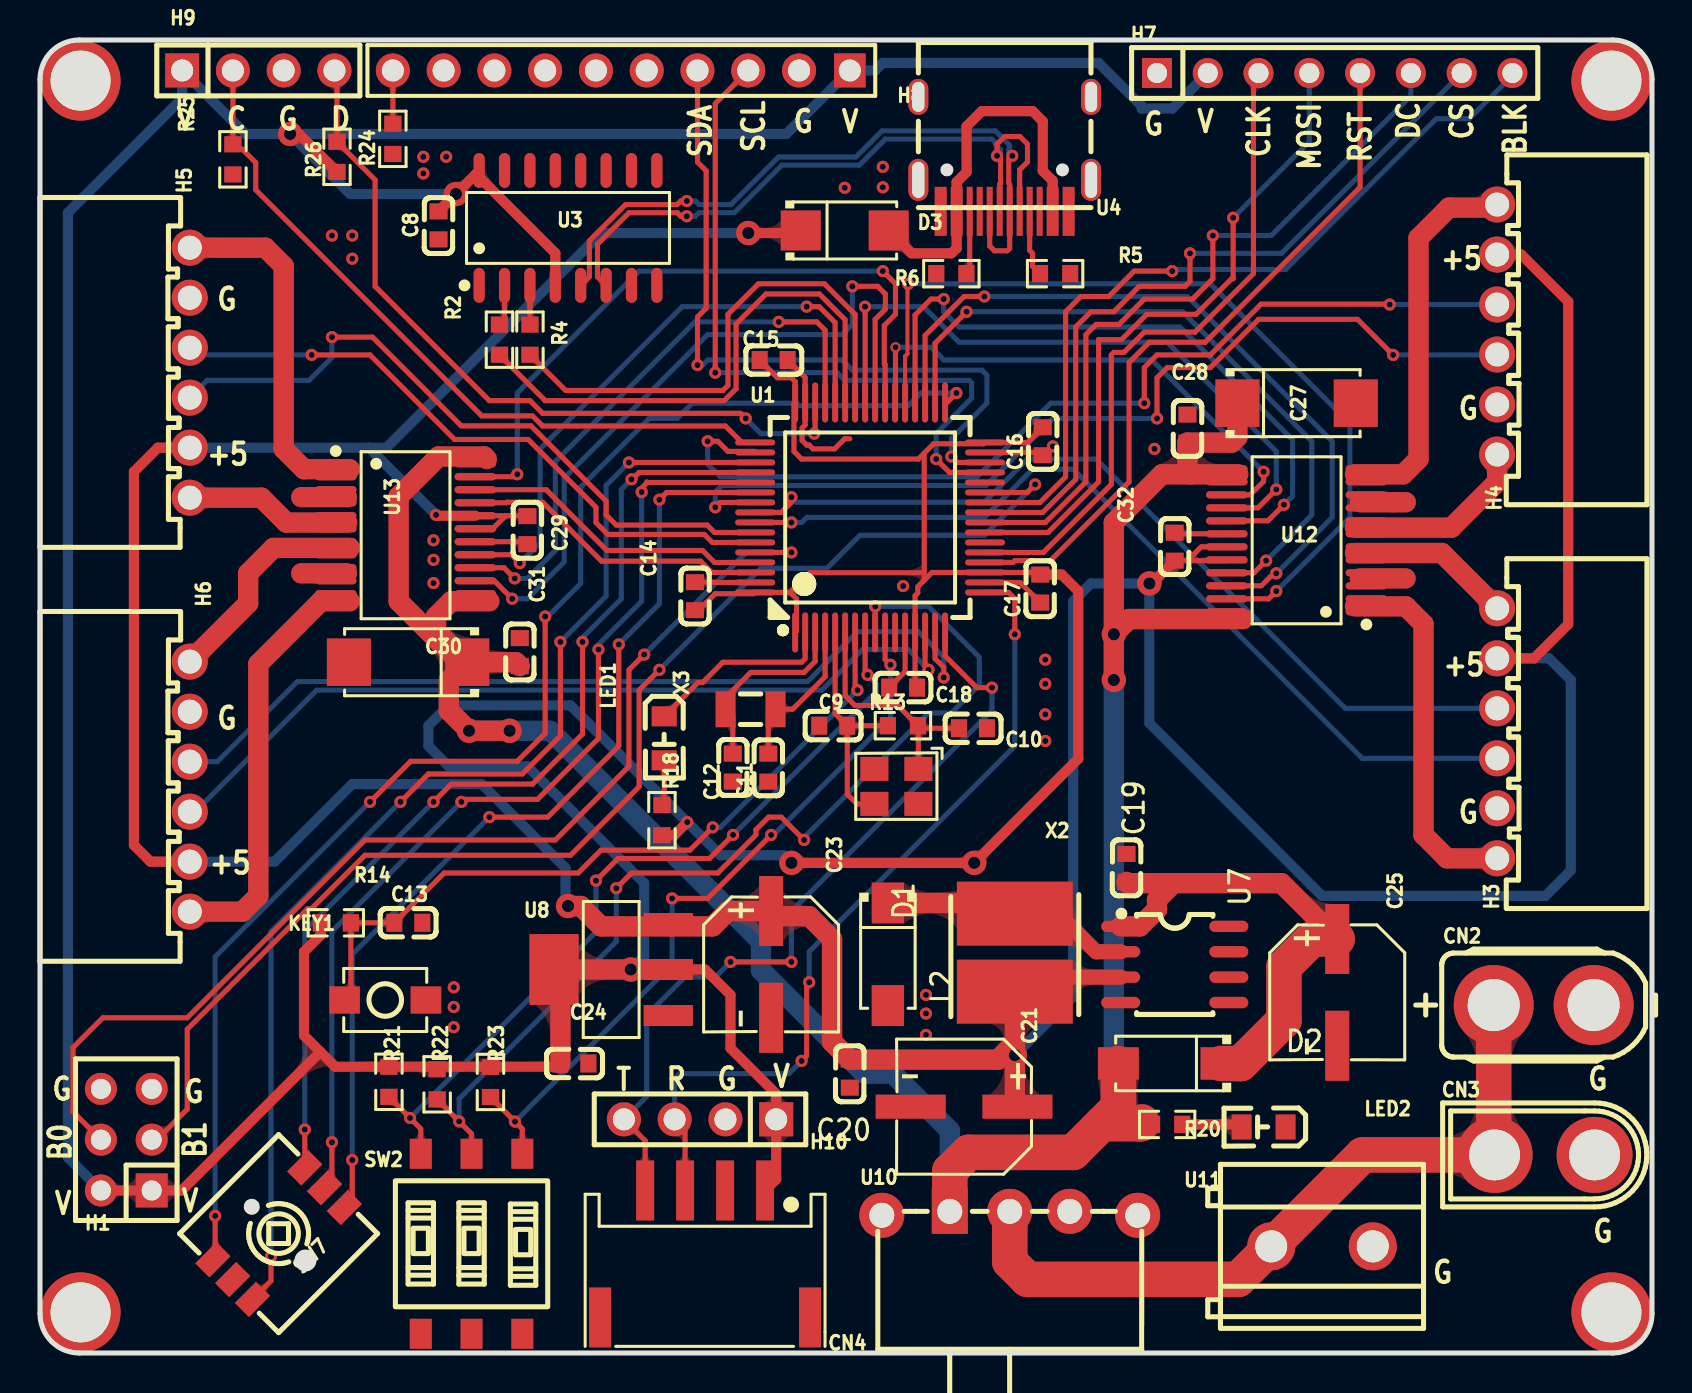
[diagram p3: board, top side]
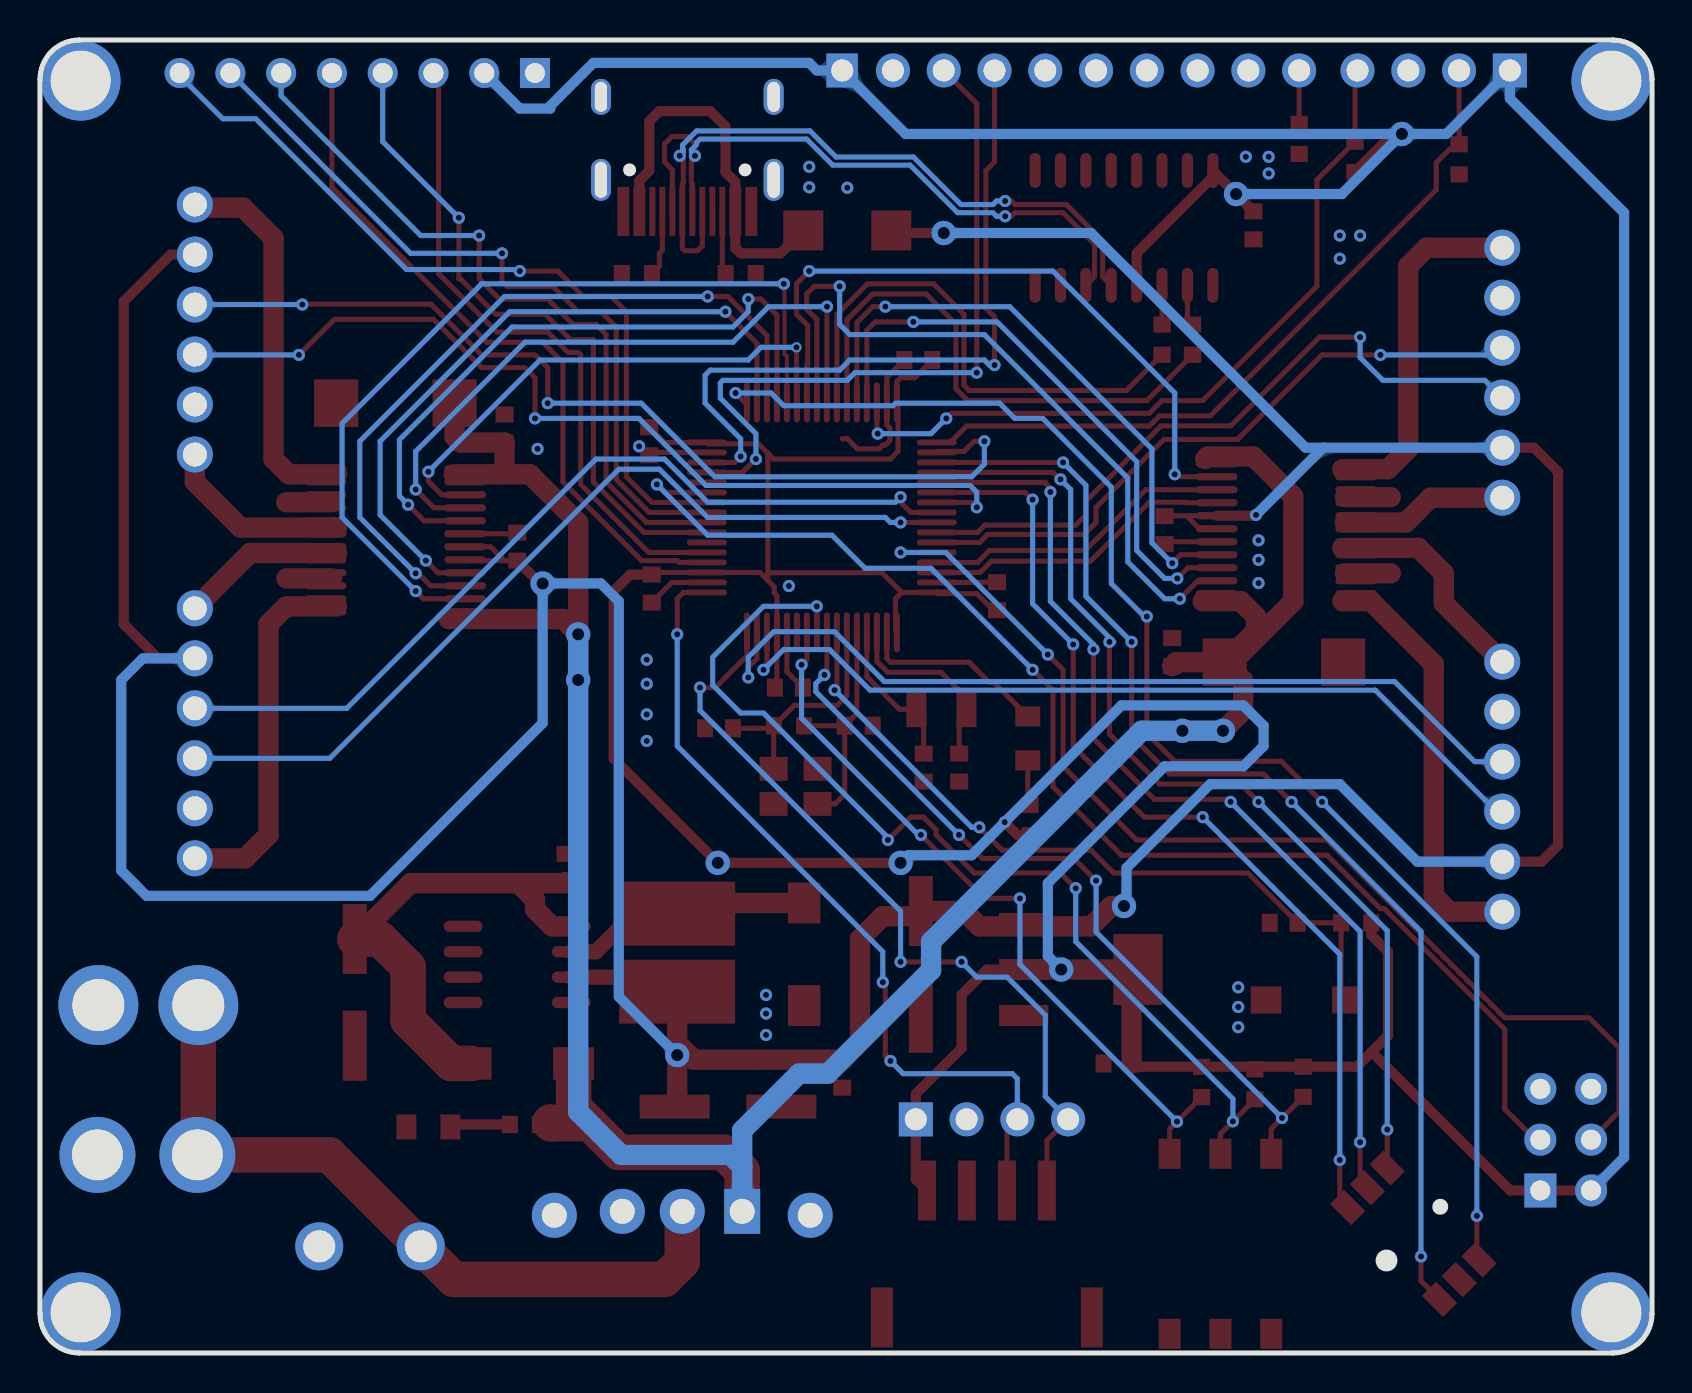
[diagram p4: board, bottom side, seen from below]

Outline 80.64 x 65.66 mm; copper layers: Top Layer, Bottom Layer. Coordinates in mm from the lower left corner of the outline.
Outline path: 0,63.69 0,1.97 arc(0.58,0.58) 1.97,0 78.67,0 arc(80.07,0.58) 80.64,1.97 80.64,63.69 arc(80.07,65.08) 78.67,65.66 1.97,65.66 arc(0.58,65.08) 0,63.69
Stack: Top Layer 0.035mm / Dielectric1 1.51mm FR4 er 4.5 / Bottom Layer 0.035mm

## Design rules (mm)
net USB_DP_IN: DP1
net USB_DN_IN: DP1
template: 用户自定义配置
spacing safeClearance (default): track to track 0.152, other pairs 0 to 0.152
track width trackWidth (default): min 0.127, default 0.254, max 2.54
track width trackWidth1: min 0.254, default 0.508, max 2.54
track width MotorPower: min 0.127, default 1.016, max 2.54
differential pair differentialPair (default): width min 0.127, default 0.254, max 2.54; gap min 0.152, default 0.152
via viaSize (default): diameter min 0.5, default 0.61, max 10; hole min 0.3, default 0.305, max 5.999
net MOTOR_POWER uses MotorPower
net +5V uses trackWidth1
net VCC uses trackWidth1

## Placement (name value [footprint] x y rotation side)
C8  10u  [C0603]  19.94 56.39 90 top
C9  10pF  [C0603]  39.69 31.37 0 top
C10  10pF  [C0603]  46.67 31.24 180 top
C11  12pF  [C0603]  36.44 29.27 90 top
C12  12pF  [C0603]  34.66 29.27 270 top
C13  10uF  [C0603]  18.43 21.51 0 top
C14  100nF  [C0603]  32.77 37.85 270 top
C15  100nF  [C0603]  36.7 49.66 180 top
C16  100nF  [C0603]  50.17 45.59 90 top
C17  100nF  [C0603]  50.04 38.23 90 top
C18  100nF  [C0603]  43.18 33.27 0 top
C19  0.1u  [C0603]  54.36 24.26 270 top
C20  0.1u  [C0603]  40.51 13.97 90 top
C21  100uF  [CAP-SMD_BD6.3-L6.6-W6.6-LS7.3-FD]  46.23 12.32 180 top
C23  100uF  [CAP-SMD_BD6.3-L6.6-W6.6-LS7.3-FD]  36.58 19.43 270 top
C24  100uF  [C0603]  26.73 14.48 180 top
C25  220uF  [CAP-SMD_BD6.3-L6.6-W6.6-LS7.3-FD]  64.9 18.03 270 top
C27  47uF  [CAP-SMD_L6.0-W3.2-R-RD]  62.86 47.5 180 top
C28  0.1uF  [C0603]  57.4 46.23 270 top
C29  0.1uF  [C0603]  24.38 41.15 90 top
C30  47uF  [CAP-SMD_L6.0-W3.2-R-RD]  18.42 34.54 0 top
C31  0.1uF  [C0603]  24 35.05 270 top
C32  0.1uF  [C0603]  56.77 40.32 270 top
CN2  XT30UPB-F  [CONN-TH_XT30UPB-F]  75.22 17.4 0 top
CN3  XT30U-M  [CONN-TH_XT30U-M]  75.27 9.91 0 top
CN4  PH-4P卧贴  [CONN-SMD_PH2.0-4PWB]  33.27 4.95 180 top
D1  SS24G  [SMA_L4.4-W2.8-LS5.4-RD]  42.42 19.94 270 top
D2  SS24G  [SMA_L4.4-W2.8-LS5.4-RD]  56.52 14.48 180 top
D3  SS24  [SMA_L4.3-W2.6-LS5.2-RD]  40.26 56.13 0 top
H1  -  [HDR-TH_6P-P2.54-V-F-R2-C3-S2.54]  4.32 10.67 90 top
H3  -  [CONN-TH_XH-6AW]  72.9 30.99 90 top
H4  -  [CONN-TH_XH-6AW]  72.9 51.18 90 top
H5  -  [CONN-TH_XH-6AW]  7.49 49.02 270 top
H6  -  [CONN-TH_XH-6AW]  7.49 28.32 270 top
H7  -  [HDR-TH_8P-P2.54-V-M]  64.77 64.01 0 top
H8  -  [HDR-TH_10P-P2.54-V-M-1]  29.08 64.14 180 top
H9  -  [HDR-TH_4P-P2.54-V-M]  10.92 64.14 0 top
H10  -  [HDR-TH_4P-P2.54-V-F]  33.02 11.68 180 top
KEY1  轻触开关3x4x2  [SW-SMD_L4.0-W2.9-LS5.0]  17.27 17.65 0 top
L2  68uH  [IND-SMD_L5.8-W5.2_CD54T125NP-100MC]  48.77 20.02 90 top
LED1  -  [LED0805-RD_RED]  31.23 30.74 270 top
LED2  -  [LED0805-RD_RED]  61.21 11.3 180 top
NOREF  -  [Pad_e5]  78.61 2.03 0 top
NOREF#2  -  [Pad_e4]  78.61 63.63 0 top
NOREF#3  -  [Pad_e6]  2.03 2.03 0 top
NOREF#4  -  [Pad_e2]  2.03 63.63 0 top
R2  220  [R0603]  22.99 50.67 270 top
R4  220  [R0603]  24.51 50.67 270 top
R5  5.1k  [R0603]  50.78 53.98 180 top
R6  5.1k  [R0603]  45.59 53.98 0 top
R13  1M  [R0603]  43.17 31.37 180 top
R14  10K  [R0603]  14.8 21.51 180 top
R18  2K  [R0603]  31.11 26.64 270 top
R20  10K  [R0603]  56.39 11.43 180 top
R21  10K  [R0603]  17.46 13.56 270 top
R22  10K  [R0603]  19.87 13.44 270 top
R23  10K  [R0603]  22.54 13.55 270 top
R24  0  [R0603]  17.65 60.71 90 top
R25  10K  [R0603]  9.65 59.69 90 top
R26  10K  [R0603]  14.86 59.82 270 top
SW2  TO-03  [SW-SMD_6P-L7.6-W6.3-P2.54-LS9.8]  21.59 5.46 0 top
SW7  7*7*5-6P-L WX  [SW-SMD_6P-L7.0-W7.0-P1.40-LS7.4]  11.94 5.97 225 top
U1  -  [LQFP-64_L10.0-W10.0-P0.50-LS12.0-BL]  41.53 41.78 0 top
U3  CH340C  [SOP-16_L10.0-W3.9-P1.27-LS6.0-BL]  26.42 56.26 0 top
U4  TYPEC-16P  [TYPEC]  48.26 60.45 180 top
U7  XL1509-5.0  [SOIC-8_L5.0-W4.0-P1.27-LS6.0-BL]  56.77 19.43 270 top
U8  AMS1117-3.3  [SOT-223_L6.5-W3.5-P2.30-LS7.0-BR]  28.58 19.18 0 top
U10  SS-12F23-G4  [SW-TH_SS-12F23-G040]  48.51 6.99 0 top
U11  KF127-5.08-2P  [CONN-TH_P5.08_KF127-5.08-2P]  64.14 5.33 0 top
U12  TB6612FNG(O,C,8,EL  [SSOP-24_L8.4-W5.8-P0.65-LS7.8-BL]  62.86 40.64 90 top
U13  TB6612FNG(O,C,8,EL  [SSOP-24_L8.4-W5.8-P0.65-LS7.8-BL]  18.29 40.89 270 top
X2  8MHz  [OSC-SMD_4P-L3.2-W2.5-BL]  42.84 28.34 180 top
X3  32.768kHz  [FC-135R_L3.2-W1.5]  35.55 32.19 180 top

## Footprints (pads in the part's own frame, mm; a bottom-side part is the same pattern mirrored in y, then rotated)
C0603
  rect 0.8x0.9 smd: 1(-0.7,0) 2(0.7,0)
CAP-SMD_BD6.3-L6.6-W6.6-LS7.3-FD
  rect 3.5x1.2 smd: 1(-2.67,0) 2(2.67,0)
CAP-SMD_L6.0-W3.2-R-RD
  rect 2.208x2.376 smd: 1(2.961,0) 2(-2.961,0)
CONN-SMD_PH2.0-4PWB
  rect 0.899x2.999 smd: 1(-2.999,-3.175) 2(-1.001,-3.175) 3(1.001,-3.175) 4(2.999,-3.175)
  rect 1.1x2.999 smd: 5(5.25,3.175) 6(-5.25,3.175)
CONN-TH_P5.08_KF127-5.08-2P
  round 2.401 hole 1.6: 1(-2.54,0) 2(2.54,0)
CONN-TH_XH-6AW
  round 1.801 hole 1.199: 1(6.251,0) 2(3.749,0) 3(1.25,0) 4(-1.25,0) 5(-3.749,0) 6(-6.251,0)
CONN-TH_XT30U-M
  round 3.8 hole 2.54: 1(-2.5,0) 2(2.5,0)
CONN-TH_XT30UPB-F
  round 4 hole 2.6: 1(-2.5,0) 2(2.5,0)
FC-135R_L3.2-W1.5
  rect 1.001x1.801 smd: 1(-1.25,0) 2(1.25,0)
HDR-TH_4P-P2.54-V-F
  rect 1.7x1.7 hole 1.1: 1(-3.81,0)
  round 1.7 hole 1.1: 2(-1.27,0) 3(1.27,0) 4(3.81,0)
HDR-TH_4P-P2.54-V-M
  rect 1.7x1.7 hole 1.1: 1(-3.81,0)
  round 1.7 hole 1.1: 2(-1.27,0) 3(1.27,0) 4(3.81,0)
HDR-TH_6P-P2.54-V-F-R2-C3-S2.54
  rect 1.7x1.6 hole 1: 1(-2.54,-1.27)
  round 1.6 hole 1: 2(-2.54,1.27) 3(0,-1.27) 4(0,1.27) 5(2.54,-1.27) 6(2.54,1.27)
HDR-TH_8P-P2.54-V-M
  rect 1.5x1.5 hole 1: 1(-8.89,0)
  round 1.5 hole 1: 2(-6.35,0) 3(-3.81,0) 4(-1.27,0) 5(1.27,0) 6(3.81,0) 7(6.35,0) 8(8.89,0)
HDR-TH_10P-P2.54-V-M-1
  rect 1.575x1.7 hole 1.1: 1(-11.43,0)
  round 1.7 hole 1.1: 2(-8.89,0) 3(-6.35,0) 4(-3.81,0) 5(-1.27,0) 6(1.27,0) 7(3.81,0) 8(6.35,0) 9(8.89,0) 10(11.43,0)
IND-SMD_L5.8-W5.2_CD54T125NP-100MC
  rect 3.2x5.8 smd: 1(-1.95,0) 2(1.95,0)
LED0805-RD_RED
  rect 1x1.25 smd: 1(-1.1,0) 2(1.1,0)
LQFP-64_L10.0-W10.0-P0.50-LS12.0-BL
  oval 0.3x2 smd: 1(-3.75,-5.75) 2(-3.25,-5.75) 3(-2.75,-5.75) 4(-2.25,-5.75) 5(-1.75,-5.75) 6(-1.25,-5.75) 7(-0.75,-5.75) 8(-0.25,-5.75) 9(0.25,-5.75) 10(0.75,-5.75) 11(1.25,-5.75) 12(1.75,-5.75) 13(2.25,-5.75) 14(2.75,-5.75) 15(3.25,-5.75) 16(3.75,-5.75) 33(3.75,5.75) 34(3.25,5.75) 35(2.75,5.75) 36(2.25,5.75) 37(1.75,5.75) 38(1.25,5.75) 39(0.75,5.75) 40(0.25,5.75) 41(-0.25,5.75) 42(-0.75,5.75) 43(-1.25,5.75) 44(-1.75,5.75) 45(-2.25,5.75) 46(-2.75,5.75) 47(-3.25,5.75) 48(-3.75,5.75)
  oval 2x0.3 smd: 17(5.75,-3.75) 18(5.75,-3.25) 19(5.75,-2.75) 20(5.75,-2.25) 21(5.75,-1.75) 22(5.75,-1.25) 23(5.75,-0.75) 24(5.75,-0.25) 25(5.75,0.25) 26(5.75,0.75) 27(5.75,1.25) 28(5.75,1.75) 29(5.75,2.25) 30(5.75,2.75) 31(5.75,3.25) 32(5.75,3.75) 49(-5.75,3.75) 50(-5.75,3.25) 51(-5.75,2.75) 52(-5.75,2.25) 53(-5.75,1.75) 54(-5.75,1.25) 55(-5.75,0.75) 56(-5.75,0.25) 57(-5.75,-0.25) 58(-5.75,-0.75) 59(-5.75,-1.25) 60(-5.75,-1.75) 61(-5.75,-2.25) 62(-5.75,-2.75) 63(-5.75,-3.25) 64(-5.75,-3.75)
OSC-SMD_4P-L3.2-W2.5-BL
  rect 1.4x1.2 smd: 1(-1.1,-0.875) 2(1.1,-0.875) 3(1.1,0.875) 4(-1.1,0.875)
Pad_e2
  round 4 hole 3: 1(0,0)
Pad_e4
  round 4 hole 3: 2(0,0)
Pad_e5
  round 4 hole 3: 3(0,0)
Pad_e6
  round 4 hole 3: 4(0,0)
R0603
  rect 0.806x0.864 smd: 1(-0.753,0) 2(0.753,0)
SMA_L4.3-W2.6-LS5.2-RD
  rect 2x2 smd: 1(-2.2,0) 2(2.2,0)
SMA_L4.4-W2.8-LS5.4-RD
  rect 2.046x1.62 smd: 1(-2.566,0) 2(2.566,0)
SOIC-8_L5.0-W4.0-P1.27-LS6.0-BL
  oval 0.569x1.95 smd: 1(-1.905,-2.705) 2(-0.635,-2.705) 3(0.635,-2.705) 4(1.905,-2.705) 5(1.905,2.705) 6(0.635,2.705) 7(-0.635,2.705) 8(-1.905,2.705)
SOP-16_L10.0-W3.9-P1.27-LS6.0-BL
  oval 0.56x1.745 smd: 1(-4.445,-2.873) 2(-3.175,-2.873) 3(-1.905,-2.873) 4(-0.635,-2.873) 5(0.635,-2.873) 6(1.905,-2.873) 7(3.175,-2.873) 8(4.445,-2.873) 9(4.445,2.873) 10(3.175,2.873) 11(1.905,2.873) 12(0.635,2.873) 13(-0.635,2.873) 14(-1.905,2.873) 15(-3.175,2.873) 16(-4.445,2.873)
SOT-223_L6.5-W3.5-P2.30-LS7.0-BR
  rect 2.465x1.05 smd: 1(2.857,-2.3) 2(2.857,0) 3(2.857,2.3)
  rect 2.465x3.54 smd: 4(-2.857,0)
SSOP-24_L8.4-W5.8-P0.65-LS7.8-BL
  oval 0.364x2.082 smd: 1(-3.575,-3.491) 2(-2.925,-3.491) 3(-2.275,-3.491) 4(-1.625,-3.491) 5(-0.975,-3.491) 6(-0.325,-3.491) 7(0.325,-3.491) 8(0.975,-3.491) 9(1.625,-3.491) 10(2.275,-3.491) 11(2.925,-3.491) 12(3.575,-3.491) 13(3.575,3.491) 14(2.925,3.491) 15(2.275,3.491) 16(1.625,3.491) 17(0.975,3.491) 18(0.325,3.491) 19(-0.325,3.491) 20(-0.975,3.491) 21(-1.625,3.491) 22(-2.275,3.491) 23(-2.925,3.491) 24(-3.575,3.491)
SW-SMD_6P-L7.0-W7.0-P1.40-LS7.4
  rect 1.5x1 smd: 1(-3.25,1.4) 2(-3.25,0) 3(-3.25,-1.4) 4(3.25,-1.4) 5(3.25,0) 6(3.25,1.4)
SW-SMD_6P-L7.6-W6.3-P2.54-LS9.8
  rect 1.1x1.501 smd: 1(-2.54,-4.501) 2(0,-4.501) 3(2.54,-4.501) 4(2.54,4.501) 5(0,4.501) 6(-2.54,4.501)
SW-SMD_L4.0-W2.9-LS5.0
  rect 1.53x1.36 smd: 1(-2.035,0) 2(2.035,0)
SW-TH_SS-12F23-G040
  rect 1.801x2.251 hole 1.25: 1(-2.999,0.099)
  round 2.251 hole 1.25: 2(0,0.099) 3(2.999,0.099) 4(6.401,-0.099) 5(-6.401,-0.099)
TYPEC
  oval 1x2.1 hole 0.61x1.8: 1(-4.32,1.788) 2(4.32,1.788)
  oval 1x1.8 hole 0.61x1.5: 3(-4.32,-2.362) 4(4.32,-2.362)
  rect 0.6x2.45 smd: A1B12(-3.2,3.362) A4B9(-2.4,3.362) B1A12(3.2,3.362) B4A9(2.4,3.362)
  rect 0.3x2.45 smd: A5(-1.25,3.362) A6(-0.25,3.362) A7(0.25,3.362) A8(-1.75,3.362) B5(1.75,3.362) B6(0.75,3.362) B7(-0.75,3.362) B8(1.25,3.362)

## Nets
As in the schematic, except:
BOOT1: H1.3 U1.27

Pads without a net: CN4 5 6; H8 5 6 7 8 9; NOREF 3; NOREF#2 2; NOREF#3 4; NOREF#4 1; U1 11 28; U3 7 8 9 10 11 12 13 14 15; U4 A8 B8; U10 3 4 5; X2 2 4

## Via types
v1: diameter 0.61, hole 0.305, Top Layer to Bottom Layer, 116 vias
v2: diameter 1.219, hole 0.61, Top Layer to Bottom Layer, 13 vias
v3: diameter 0.508, hole 0.305, Top Layer to Bottom Layer, 1 via

## Routing (per net, layer and track width the routed paths; a pad name or vN(x,y) marks a point on that pad's centre or on a via; arc(x,y) is an arc through that point)
+5V: length 242
  Top Layer w0.254: 23.29,41.87 24.36,41.87 C29.2 ; 23.29,41.87 21.78,41.87 ; 23.29,41.87 22.64,41.22 U13.19 ; 57.4,39.62 59.33,39.62 U12.20 ; 57.4,39.62 58.09,40.32 U12.19 ; 57.4,39.62 C32.2
  Top Layer w0.508: 21.78,41.87 19.85,41.87 v1(19.81,41.91) ; v2(55.5,38.48) 55.63,38.48 C32.2 ; v2(35.43,56.01) 37.93,56.01 D3.1 ; H5.2 5.9,45.27 4.7,44.07 4.7,25.4 5.53,24.57 H6.2 ; H3.2 74.74,34.74 76.45,36.45 76.45,52.58 74.1,54.93 H4.2
  Top Layer w0.762: 54.06,18.8 49.49,18.8 L2.1
  Top Layer w1.016: 31.57,21.34 33.65,21.34 34.42,22.1 C23.1 36.83,21.84 38.48,21.84 39.62,20.7 39.62,15.56 C20.2 47.94,14.67 48.77,15.5 ; 31.57,21.34 U8.3 ; 31.57,21.34 28.07,21.34 27.05,22.35 v2(26.42,22.35) ; 48.77,15.5 L2.1 ; 48.77,15.5 v2(48.77,14.9) 48.77,12.45 C21.1
  Bottom Layer w0.508: 16.45,45.27 17.33,45.27 28.07,56.01 v2(35.43,56.01) ; 16.45,45.27 H5.2 ; 16.45,45.27 v1(19.81,41.91) ; v2(48.77,14.9) 51.69,17.82 51.69,37.59 52.58,38.48 v2(55.5,38.48) 55.5,31.5 64.14,22.86 75.31,22.86 76.58,24.13 76.58,33.66 75.5,34.74 H3.2 ; v2(26.42,22.35) 26.29,22.48 26.29,24.26 22.1,28.45 15.62,28.45 11.74,24.57 H6.2
+12V: length 25.5
  Top Layer w1.016: 54.06,21.34 55.03,21.34 55.88,22.19 55.88,22.67 56.71,23.5 ; 56.71,23.5 62.11,23.5 C25.1 ; 56.71,23.5 54.42,23.5 C19.2
  Top Layer w1.778: D2.1 60.07,14.48 62.23,16.64 62.23,19.3 63.63,20.7 C25.1
GND: length 37.6
  Top Layer w0.254: U13.18 24.26,40.57 C29.1 ; 66.36,42.92 67.7,42.92 67.7,42.27 ; C14.1 33.72,38.55 33.73,38.53 U1.63 ; U1.12 43.28,34.07 C18.1 ; C32.1 56.82,40.97 U12.18 ; C15.1 38.28,48.78 U1.47 38.28,46.41 38.13,46.25 38.13,45.63 38.36,45.4 38.48,45.4 38.67,45.21 39.75,45.21 40.26,45.72 40.51,45.72 ; 50.17,44.89 50.02,45.03 U1.31 ; U1.18 49.03,38.53 C17.1 ; 67.7,42.27 68.05,42.27 ; 67.7,42.27 U12.9
  Top Layer w1.016: 66.03,38.74 68.32,38.74 ; 66.04,42.55 68.33,42.55 ; 13.07,38.99 15.36,38.99 ; 13.07,42.8 15.36,42.8
  vias: v1(14.6,55.88) v1(15.62,55.88) v1(15.62,54.72) v1(19.18,59.82) v1(19.18,58.98) v1(19.68,40.64) v1(19.68,39.66) v1(19.68,38.5) v1(20.32,59.82) v1(20.7,18.29) v1(20.7,17.3) v1(20.7,16.29) v1(40.26,58.27) v1(42.16,59.32) v1(42.16,58.29) v1(43.18,38.35) v1(44.32,17.91) v1(44.32,16.97) v1(44.32,15.91) v1(50.29,34.67) v1(50.29,33.46) v1(50.29,31.94) v1(50.29,30.61) v1(50.67,45.34) v1(55.75,45.21)
VCC: length 317
  Top Layer w0.254: C18.2 43.78,33.38 U1.13 43.78,37.87 43.92,38.01 43.92,38.32 44.23,38.64 ; 37.53,38.03 38.52,39.02 44.23,39.02 ; 37.53,38.03 37.85,37.72 37.85,36.1 U1.1 ; 37.53,38.03 U1.64 35.72,37.97 33.78,37.97 32.95,37.15 C14.2 ; C15.2 36.89,48.77 37.59,48.77 37.78,48.58 U1.48 37.72,47.47 37.72,45.09 38.1,44.7 43.94,44.7 44.23,45 ; C16.2 49.4,45.53 U1.32 47.21,45.47 44.7,45.47 44.23,45 ; 44.23,39.02 44.23,38.64 ; 44.23,39.02 44.23,45 ; 44.23,38.64 44.63,39.03 U1.19 49.93,39.03 C17.2
  Top Layer w0.508: 22.53,14.32 25.87,14.32 C24.2 ; 22.53,14.32 22.54,14.31 ; 22.53,14.32 R21.1 14.77,14.32 14.02,15.06 ; 14.02,15.06 7.09,8.13 H1.1 H1.2 ; 14.02,15.06 13.21,15.88 13.21,20.07 14.05,20.9 R14.2 ; v2(12.51,60.96) 12.96,60.96 R26.2 ; CN4.1 36.83,8.68 H10.1 36.83,12.95 34.54,15.24 34.54,17.91 33.27,19.18 U8.2 ; C8.2 v2(20.81,57.96) 21.82,58.97 ; U3.16 21.97,59.12 21.82,58.97 ; v1(32.38,26.55) 31.72,25.89 R18.2 ; v2(37.59,24.51) v2(46.74,24.51) 51.94,29.72 51.94,38.1 51.12,38.93 C17.2 ; 21.82,58.97 25.78,55 U3.4
  Top Layer w1.016: C24.2 26.03,18.42 25.65,18.8 ; U8.2 v2(29.56,19.18) U8.4
  Bottom Layer w0.508: v2(12.51,60.96) 37.34,60.96 H8.1 41.78,64.14 42.16,64.52 52.96,64.52 55.12,62.36 55.12,62.23 56.64,62.23 H7.2 ; v2(12.51,60.96) 15.52,57.96 v2(20.81,57.96) ; v2(12.51,60.96) 10.29,60.96 H9.1 7.11,62.74 1.4,57.02 1.4,9.78 H1.2 ; v2(37.59,24.51) 37.21,24.89 34.04,24.89 v1(32.38,26.55) 26.54,32.39 20.45,32.39 19.43,31.37 19.43,30.35 20.45,29.34 24.38,29.34 30.23,23.5 30.23,19.85 v2(29.56,19.18)
AIN1_1: length 34.3
  Top Layer w0.254: v1(46.36,52.07) 44.78,50.49 U1.34 ; v1(61.34,39.62) 60.73,39.02 U12.21
  Bottom Layer w0.254: v1(61.34,39.62) 63.63,41.91 63.63,45.59 57.15,52.07 v1(46.36,52.07)
AIN1_2: length 37.9
  Top Layer w0.254: 61.72,38.99 61.1,38.37 U12.22 ; U1.35 44.28,50.88 46.23,52.83 v1(47.24,52.83)
  Bottom Layer w0.254: v1(61.85,38.99) 64.64,41.78 64.64,45.59 57.4,52.83 v1(47.24,52.83)
AIN2_1: length 15.5
  Top Layer w0.254: U13.21 23.34,42.52 23.37,42.55 25.15,42.55 28.09,39.6 33.05,39.6 33.61,39.03 U1.62
AIN2_2: length 15.5
  Top Layer w0.254: U1.61 33.75,39.53 33.15,40.13 28.36,40.13 25.32,43.17 U13.22
BIN1_1: length 33.5
  Top Layer w0.254: U12.17 61.43,41.62 v1(62.23,42.42) ; v1(45.21,52.71) 44.58,52.71 43.78,51.91 U1.36
  Bottom Layer w0.254: v1(62.23,42.42) 62.66,42.85 62.66,45.67 57.02,51.31 45.97,51.31 45.21,52.07 v1(45.21,52.71)
BIN1_2: length 33.1
  Top Layer w0.254: U1.41 41.28,52.32 v1(41.27,52.32) ; v1(61.85,43.18) 60.93,42.27 U12.16
  Bottom Layer w0.254: v1(61.85,43.18) 61.85,45.09 56.39,50.55 45.97,50.55 44.2,52.32 v1(41.27,52.32)
BIN2_1: length 30.6
  Top Layer w0.254: U1.44 39.78,51.52 38.98,52.32 v1(38.35,52.32) ; v1(24,39.5) 23.58,39.92 U13.17
  Bottom Layer w0.254: v1(24,39.5) 25.02,40.51 25.02,45.21 32.13,52.32 v1(38.35,52.32)
BIN2_2: length 29.4
  Top Layer w0.254: U13.16 23.21,39.27 v1(23.75,38.74) ; v1(36.96,51.56) 38.86,51.56 39.28,51.15 U1.45
  Bottom Layer w0.254: v1(23.75,38.74) 24.38,38.74 25.78,40.13 25.78,44.58 32.77,51.56 v1(36.96,51.56)
BOOT0: length 56
  Top Layer w0.254: U1.60 v1(37.59,40.03) ; H1.4 1.65,12.07 1.65,15.27 3.14,16.76 7.37,16.76 16.26,25.65 25.78,25.65 29.46,29.34 29.46,34.16 v1(30.23,34.93)
  Bottom Layer w0.254: v1(37.59,40.03) 35.33,40.03 v1(30.23,34.93)
BOOT1: length 65.6
  Top Layer w0.254: H1.3 5.84,10.67 7.37,12.19 7.37,16.19 13.4,22.22 13.58,22.22 16.26,24.89 26.54,24.89 29.97,28.32 29.97,33.15 v1(30.99,34.16) ; U1.27 49.38,43.03 v1(49.78,43.43)
  Bottom Layer w0.254: v1(49.78,43.43) 47.24,40.89 41.02,40.89 39.37,39.24 36.07,39.24 v1(30.99,34.16)
CH340_RXD: length 2
  Top Layer w0.254: R4.1 U3.3
CH340_TXD: length 2.1
  Top Layer w0.254: U3.2 23.24,51.68 R2.1
I2C2_SCL: length 36.1
  Top Layer w0.254: U1.29 45.5,44.03 v1(44.83,44.7) ; v1(33.78,49.02) 33.78,62.48 H8.3
  Bottom Layer w0.254: v1(44.83,44.7) 44.83,45.97 46.61,47.75 46.61,48.51 46.48,48.64 40.26,48.64 39.88,49.02 v1(33.78,49.02)
I2C2_SDA: length 36.6
  Top Layer w0.254: v1(32.89,49.4) 32.89,51.81 33.33,52.24 33.33,59.12 32.89,59.55 H8.4 ; v1(45.59,44.83) 45.89,44.53 U1.30
  Bottom Layer w0.254: v1(45.59,44.83) 45.59,45.72 47.37,47.5 47.37,48.9 47.12,49.15 40.64,49.15 40.13,49.66 33.4,49.66 33.15,49.4 v1(32.89,49.4)
KEY1: length 48.6
  Top Layer w0.254: v1(22.48,26.8) 25.4,26.8 28.96,30.35 v1(28.96,35.43) ; v1(30.99,42.67) 31.35,43.03 U1.54 ; v1(15.62,9.65) 15.62,7.67 15.23,7.28
  Bottom Layer w0.254: v1(30.99,42.67) 30.99,37.47 v1(28.96,35.43) ; v1(22.48,26.8) 15.62,19.94 v1(15.62,9.65)
KEY2: length 49.4
  Top Layer w0.254: v1(14.6,10.54) 14.6,8.64 14.24,8.27 ; 30.38,43.53 30.35,43.56 ; 30.38,43.53 U1.53 ; 30.38,43.53 30.1,43.25 v1(30.1,43.05) ; v1(21.08,27.56) 21.21,27.69 24.89,27.69 27.94,30.73 v1(27.94,35.18)
  Bottom Layer w0.254: v1(30.1,43.05) 30.1,37.59 27.94,35.43 27.94,35.31 ; v1(14.6,10.54) 14.6,21.08 v1(21.08,27.56)
KEY3: length 50
  Top Layer w0.254: v1(27.14,35.56) 27.14,30.95 24.64,28.45 20.58,28.45 v1(19.68,27.56) ; v1(29.59,43.69) 29.63,43.69 29.97,44.03 U1.52 ; 13.25,9.26 v1(13.25,11.18)
  Bottom Layer w0.254: 26.92,35.56 29.08,37.72 29.08,43.18 v1(29.59,43.69) ; v1(19.68,27.56) 13.25,21.12 v1(13.25,11.18)
KEY4: length 58.7
  Top Layer w0.254: v1(11.56,4.83) 11.56,3.61 10.63,2.68 ; v1(18.03,27.56) 19.43,28.96 24.13,28.96 26.03,30.86 v1(26.03,35.56) ; U1.51 v1(29.46,44.53)
  Bottom Layer w0.254: v1(11.56,4.83) 11.56,21.08 v1(18.03,27.56) ; v1(29.46,44.53) 28.32,43.39 28.32,37.85 v1(26.03,35.56)
KEY5: length 71.1
  Top Layer w0.254: U1.33 45.37,47.53 v1(45.85,48.01) ; v1(25.27,36.83) 25.27,30.99 23.88,29.59 18.54,29.59 v1(16.51,27.56) ; v1(8.76,6.86) 8.76,4.77 8.65,4.66
  Bottom Layer w0.254: v1(25.27,36.83) 25.4,36.83 27.05,38.48 27.05,43.31 30.48,46.74 31.88,46.74 32.64,47.5 37.85,47.5 37.97,47.37 43.43,47.37 44.07,48.01 v1(45.85,48.01) ; v1(16.51,27.56) 8.76,19.81 v1(8.76,6.86)
LED: length 9.6
  Top Layer w0.254: U1.2 38.28,34.72 38.1,34.54 34.16,34.54 33.15,33.53 32.92,33.53 LED1.1
MOTOR1_1: length 18.5
  Top Layer w1.016: 65.79,37.34 68.33,37.34 69.21,36.45 69.21,25.91 70.39,24.74 H3.6
MOTOR1_2: length 8.3
  Top Layer w1.016: 65.79,40.01 70.13,40.01 72.9,37.24
MOTOR2_1: length 9.4
  Top Layer w1.016: H4.6 72.9,43.56 70.61,41.28 65.79,41.28
MOTOR2_2: length 19.2
  Top Layer w1.016: H4.1 72.74,57.28 70.48,57.28 68.96,55.75 68.96,44.7 68.2,43.94 65.79,43.94
MOTOR3_1: length 17.9
  Top Layer w1.016: H5.6 11.27,55.27 12.19,54.36 12.19,45.21 13.21,44.2 15.49,44.2
MOTOR3_2: length 8.4
  Top Layer w1.016: H5.1 11.08,42.77 12.32,41.53 15.37,41.53
MOTOR4_1: length 11.2
  Top Layer w1.016: 15.49,40.26 11.68,40.26 10.41,38.99 10.41,37.49 H6.6
MOTOR4_2: length 21.2
  Top Layer w1.016: 15.49,37.59 14.06,37.59 10.92,34.46 10.92,22.86 10.13,22.07 H6.1
MOTOR_POWER: length 144.5
  Top Layer w1.016: 22.48,37.59 20.57,37.59 19.81,36.83 19.81,36.07 19.85,36.07 C30.1 ; 57.58,43.94 57.4,44.12 C28.2 59.62,45.53 59.9,45.81 C27.1 ; 57.58,43.94 59.94,43.94 ; 57.58,43.94 56.13,43.94 53.72,41.53 v2(53.72,35.94) ; 60.2,36.7 54.48,36.7 v2(53.72,35.94) ; C30.1 20.45,33.62 20.45,32.13 v2(21.46,31.12) v2(23.49,31.12) ; C30.1 23.81,34.54 C31.2 ; C30.1 20.99,34.54 17.94,37.59 17.94,42.83 19.94,44.83 22.22,44.83 22.35,44.7 ; v2(53.72,35.94) v2(53.72,33.66)
  Top Layer w1.778: 53.13,11.47 55.03,11.47 ; 53.13,11.47 51.69,10.03 46.45,10.03 45.51,9.1 U10.1 ; 53.13,11.47 53.95,12.29 D2.2 ; 55.03,11.47 55.12,11.56 ; 55.03,11.47 55.12,11.47
  Bottom Layer w1.016: U10.1 45.51,9.32 ; 45.51,9.32 46.1,9.91 51.56,9.91 53.72,12.07 v2(53.72,33.66) v2(53.72,35.94) ; 45.51,9.32 45.51,11.13 42.67,13.97 41.23,13.97 36.07,19.14 36.07,20.57 25.53,31.12 v2(23.49,31.12) v2(21.46,31.12)
NRST: length 37.1
  Top Layer w0.254: v1(33.65,26.29) 32.51,25.15 28.07,25.15 26.92,24 20.21,24 C13.1 R14.1 15.55,17.97 KEY1.1 ; U1.7 40.78,33.26 v1(40.89,33.15)
  Bottom Layer w0.254: v1(33.65,26.29) 34.04,26.29 v1(40.89,33.15)
OSC32_IN: length 9.6
  Top Layer w0.254: C12.1 34.66,31.83 X3.2 34.3,32.77 35.56,34.04 38.23,34.04 38.78,34.59 U1.3
OSC32_OUT: length 7.7
  Top Layer w0.254: U1.4 39.28,33.82 37.65,32.19 X3.1 36.44,31.83 C11.2
OSC_IN: length 11.9
  Top Layer w0.254: U1.5 39.78,31.98 C9.2 ; C9.2 R13.2 ; C9.2 40.39,27.94 40.87,27.46 X2.3
OSC_OUT: length 11.7
  Top Layer w0.254: 43.94,31.35 44.05,31.24 C10.2 ; 43.94,31.35 X2.1 ; 43.94,31.35 R13.1 42.91,32.39 40.77,32.39 40.28,32.87 U1.6
POWER: length 37.2
  Top Layer w1.778: U10.2 48.51,4.57 49.4,3.68 59.94,3.68 U11.1 66.17,9.91 CN3.1 72.72,9.95 CN2.1
PWM1: length 43.5
  Top Layer w0.203: v1(43.43,53.47) 43.4,53.43 43.4,49.96 43.28,49.84 U1.37
  Top Layer w0.254: 59.37,37.72 61.46,37.72 v1(61.85,38.1)
  Bottom Layer w0.254: v1(43.43,53.47) 58.55,53.47 65.53,46.48 65.53,41.78 v1(61.85,38.1)
PWM2: length 26.4
  Top Layer w0.254: v1(61.21,44.07) 61.21,43.59 60.54,42.92 59.37,42.92 ; U1.38 42.8,47.55 v3(42.8,50.29)
  Bottom Layer w0.254: v3(42.8,50.29) 44.58,50.29 45.21,49.66 55.63,49.66 v1(61.21,44.07)
PWM3: length 34.1
  Top Layer w0.254: v1(42.16,54.1) 42.8,53.47 42.8,51.94 42.24,51.38 42.24,49.46 42.28,49.42 U1.39 ; v1(23.88,43.94) 23.75,43.82 U13.23
  Bottom Layer w0.254: v1(42.16,54.1) 29.97,54.1 23.88,48.01 v1(23.88,43.94)
PWM4: length 36.7
  Top Layer w0.254: U13.15 22.72,38.62 v1(23.62,37.72) ; v1(40.64,53.34) 41.91,53.34 42.29,52.96 42.29,52.2 41.78,51.69 U1.40
  Bottom Layer w0.254: v1(40.64,53.34) 40.64,51.44 40.13,50.93 33.4,50.93 26.23,43.75 26.23,39.56 24.38,37.72 v1(23.62,37.72)
SPI1_BLK: length 40.2
  Top Layer w0.254: v1(56.64,54.1) 54.74,54.1 53.47,52.83 52.07,52.83 51.31,52.07 51.31,43.82 50.03,42.53 U1.26
  Bottom Layer w0.254: H7.8 73.66,63.88 71.5,61.72 69.85,61.72 62.31,54.18 56.72,54.18 v1(56.64,54.1)
SPI1_CLK: length 33.1
  Top Layer w0.254: U1.21 50.19,40.03 53.59,43.43 53.59,49.91 53.72,50.04 54.23,50.04 55.24,51.05 57.78,51.05 60.71,53.98 60.71,63.75 H7.3
SPI1_CS: length 38.2
  Top Layer w0.254: v1(57.53,54.99) 57.53,53.58 57.29,53.34 54.99,53.34 53.72,52.07 52.58,52.07 51.82,51.31 51.82,43.69 50.16,42.03 U1.25
  Bottom Layer w0.254: v1(57.53,54.99) 62.1,54.99 H7.7
SPI1_DC: length 36.9
  Top Layer w0.254: U1.24 50.3,41.53 52.32,43.56 52.32,50.93 52.83,51.44 53.97,51.44 55.24,52.71 57.66,52.71 58.67,53.72 v1(58.67,55.88)
  Bottom Layer w0.254: v1(58.67,55.88) 61.59,55.88 68.58,62.87 H7.6
SPI1_MOSI: length 33.7
  Top Layer w0.254: U1.23 50.43,41.03 52.96,43.56 52.96,50.67 54.1,50.67 55.37,51.94 57.83,51.94 59.61,53.72 59.69,53.72 v1(59.69,56.77)
  Bottom Layer w0.254: H7.4 63.5,60.58 v1(59.69,56.77)
SPI1_RST: length 35.8
  Top Layer w0.254: U1.20 48.68,39.53 48.77,39.63 50.55,39.63 54.48,43.56 54.48,49.53 55.5,50.55 58.25,50.55 58.27,50.53 66.04,58.29 H7.5
SW_1: length 40.4
  Top Layer w0.254: v1(34.67,25.91) 33.49,24.73 28.92,24.73 v1(27.81,23.62) ; v1(41.4,33.91) 41.28,34.03 U1.8 ; SW2.6 19.05,11.22 v1(18.51,11.75) 17.46,12.81
  Bottom Layer w0.254: v1(18.51,11.75) 27.81,21.06 v1(27.81,23.62) ; v1(34.67,25.91) 41.83,33.07 41.83,33.48 v1(41.4,33.91)
SW_2: length 50.7
  Top Layer w0.254: v1(28.83,23.24) 29.59,24 33.91,24 35.81,25.91 35.81,26.16 36.45,26.8 37.08,26.8 v1(38.23,25.65) ; v1(41.78,37.34) 41.78,36.04 U1.9 ; SW2.5 21.59,10.96 v1(20.97,11.58) R22.2
  Bottom Layer w0.254: v1(41.78,37.34) 44.45,37.34 46.99,34.8 46.99,33.4 45.59,32 44.45,32 38.23,25.78 ; v1(20.97,11.58) 20.97,12.71 28.83,20.57 v1(28.83,23.24)
SW_3: length 37
  Top Layer w0.254: v1(42.55,34.42) 42.28,34.68 U1.10 ; v1(31.62,22.73) 33.4,22.73 v1(36.58,25.91) ; SW2.4 24.13,11.21 v1(23.76,11.57) R23.2
  Bottom Layer w0.254: v1(23.76,11.57) 31.62,19.43 v1(31.62,22.73) ; v1(42.55,34.42) 42.55,31.75 36.7,25.91 v1(36.58,25.91)
SWCLK: length 36.8
  Top Layer w0.254: H9.2 R25.2 9.9,60.2 10.12,60.2 10.79,59.53 10.79,58.17 22.1,46.86 24.64,46.86 25.15,46.36 34.29,46.36 35.11,45.53 U1.49
SWDIO: length 38.2
  Top Layer w0.254: v1(35.31,46.74) 35.05,46.99 25.15,46.99 24.51,47.63 22.48,47.63 16.76,53.34 16.76,58.67 R26.1 14.86,64.01 H9.4 ; U1.46 38.78,46.02 v1(38.73,45.97)
  Bottom Layer w0.254: v1(35.31,46.74) 36.07,45.97 v1(38.73,45.97)
TIM2_CH1: length 48
  Top Layer w0.254: v1(33.4,45.59) 33.91,45.59 34.42,45.09 35.73,45.09 U1.50 ; 67.44,52.45 61.09,52.45 58.55,49.91 55.88,49.91 55.24,49.28 v1(55.24,47.5)
  Bottom Layer w0.254: v1(33.4,45.59) 33.4,44.45 34.04,43.82 46.88,43.82 50.57,47.5 v1(55.24,47.5) ; H4.3 v1(67.52,52.43)
TIM2_CH2: length 47.5
  Top Layer w0.254: v1(67.69,49.91) 65.91,51.69 60.96,51.69 58.55,49.28 56.39,49.28 55.88,48.77 v1(55.88,46.74) ; v1(33.78,42.29) 34.02,42.53 U1.55
  Bottom Layer w0.254: v1(33.78,42.29) 33.78,43.05 34.11,43.38 47.33,43.38 50.68,46.74 v1(55.88,46.74) ; v1(67.69,49.91) 72.88,49.91 H4.4
TIM3_CH1: length 43.7
  Top Layer w0.254: v1(37.59,42.8) 37.59,42.55 37.08,42.03 U1.56
  Bottom Layer w0.254: v1(37.59,42.8) 37.85,42.55 47.24,42.55 49.4,44.7 52.83,44.7 65.3,32.24 H3.3
TIM3_CH2: length 44.2
  Top Layer w0.254: U1.57 v1(37.59,41.53)
  Bottom Layer w0.254: H3.4 66.15,29.74 51.69,44.2 49.66,44.2 47.25,41.79 38.36,41.79 38.1,41.53 v1(37.59,41.53)
TIM4_CH1: length 34.6
  Top Layer w0.254: v1(14.6,50.8) 16.64,50.8 21.07,46.36 24.56,46.36 28.32,42.6 28.32,41.91 28.83,41.4 33.38,41.4 33.74,41.03 U1.58
  Bottom Layer w0.254: v1(14.6,50.8) 14.6,49.78 13.46,48.64 8.36,48.64 H5.3
TIM4_CH2: length 32.8
  Top Layer w0.254: v1(13.59,49.91) 16.51,49.91 20.74,45.68 24.42,45.68 27.81,42.29 27.81,41.53 28.41,40.93 33.23,40.93 33.64,40.53 U1.59
  Bottom Layer w0.254: H5.4 7.85,49.91 v1(13.59,49.91)
TIM5_CH1: length 42.7
  Top Layer w0.254: v1(44.45,34.16) 44.28,34.33 U1.14
  Bottom Layer w0.254: v1(44.45,34.16) 43.43,35.18 41.15,35.18 39.12,33.15 13.84,33.15 7.77,27.07 H6.3
TIM5_CH2: length 44.4
  Top Layer w0.254: U1.15 44.78,34.72 45.21,34.29 v1(45.21,33.78)
  Bottom Layer w0.254: v1(45.21,33.78) 45.21,34.8 43.94,36.07 40.89,36.07 38.4,33.58 12.88,33.58 8.87,29.57 H6.4
USART1_RX: length 27
  Top Layer w0.254: R2.2 22.99,49.91 25.27,47.63 34.23,47.63 34.82,48.22 34.82,51.46 36.32,52.96 38.99,52.96 40.28,51.67 U1.43
USART1_TX: length 26.3
  Top Layer w0.254: R4.2 26.3,48.13 34.16,48.13 34.42,48.39 34.42,51.94 35.94,53.47 39.24,53.47 40.78,51.93 U1.42
USART2_RX: length 41.7
  Top Layer w0.254: v1(38.1,14.61) 38.35,14.86 38.35,18.42 v1(38.48,18.54) ; U1.17 48.45,38.03 48.77,37.72 v1(48.77,35.94) ; CN4.3 32.27,11.16 H10.3
  Bottom Layer w0.254: v1(38.48,18.54) 38.48,20.07 48.77,30.35 v1(48.77,35.94) ; v1(38.1,14.61) 37.46,13.97 32,13.97 31.75,13.72 H10.3
USART2_TX: length 40.1
  Top Layer w0.254: CN4.4 30.27,10.62 H10.4 ; v1(47.62,33.27) 46.86,33.27 45.28,34.86 U1.16 ; v1(37.59,19.56) v1(34.54,19.56)
  Bottom Layer w0.254: v1(37.59,19.56) 37.59,22.1 47.62,32.13 v1(47.62,33.27) ; H10.4 30.35,12.83 30.35,16.89 32.26,18.8 33.78,18.8 v1(34.54,19.56)
USB_DN_IN: length 34.1
  Top Layer w0.254: U4.A7 48.01,58.44 48.06,58.49 48.06,59.69 v1(47.88,59.87) 47.88,60.45 48.26,60.83 49.02,60.83 49.4,60.45 49.4,59.56 49.01,59.17 U4.B7 ; U3.6 27.89,53.82 27.89,55.45 29.46,57.02 31.88,57.02 32.05,56.85 v1(32.36,56.85)
  Bottom Layer w0.254: 47.62,60.71 47.8,60.53 47.8,60.43 48.06,60.17 48.06,60.05 v1(47.88,59.87) ; v1(32.36,56.85) 32.79,56.85 32.97,57.02 34.74,57.02 37.12,59.4 40.99,59.4 42.29,60.71 47.52,60.71
USB_DP_IN: length 34.4
  Top Layer w0.254: v1(48.64,59.87) 48.46,59.69 48.46,58.49 48.51,58.44 U4.A6 48.51,55.24 48.39,55.12 47.75,55.12 47.51,55.36 U4.B6 ; U3.5 27.48,53.82 27.48,55.62 29.3,57.43 31.88,57.43 32.05,57.61 v1(32.36,57.61)
  Bottom Layer w0.254: v1(48.64,59.87) 48.46,60.05 48.46,60.17 48.5,60.21 48.5,60.41 47.79,61.11 42.12,61.11 40.82,59.81 36.95,59.81 34.57,57.43 32.97,57.43 32.79,57.61 v1(32.36,57.61)
$1N10210: length 2.3
  Top Layer w0.254: R18.1 31.23,27.51 LED1.2
$3N961: length 12.7
  Top Layer w0.762: 54.06,20.07 52.83,20.07 50.93,21.97 48.77,21.97
  Top Layer w1.016: D1.1 48.23,22.5 48.77,21.97
$3N15267: length 2.7
  Top Layer w0.254: R24.2 H8.10
$3N17066: length 3
  Top Layer w0.508: LED2.2 59.99,11.43 R20.1
$3N19129: length 3.3
  Top Layer w0.254: U4.A5 49.51,55.14 49.66,54.99 49.66,54.35 R5.2
$3N19130: length 3.2
  Top Layer w0.254: U4.B5 46.51,54.14 R6.2
$3N19140: length 19.3
  Top Layer w0.508: U4.A4B9 50.66,58.62 50.17,59.12 50.17,61.6 49.66,62.1 47.12,62.1 46.36,61.34 46.36,59.06 45.86,58.56 U4.B4A9 45.86,55.25 45.85,55.25 45.59,54.99 43.6,54.99 D3.2

## Copper pours and planes (outline as drawn; the poured copper is in the pictures)
GND on Top Layer: -3.68,68.71 84.96,68.71 84.96,-5.46 -3.68,-5.46
GND on Bottom Layer: -4.95,66.42 88.27,66.42 88.27,-1.78 -4.95,-1.78

Small or netless copper shapes (teardrops, artwork), in the pictures only: 353 on Top Layer, 127 on Bottom Layer

## Text on the board
Top Silkscreen Layer: G | V | +5 | C | D | B0 | B1 | SDA | SCL | CLK | MOSI | RST | DC | CS | BLK | T | R
